# EAGLE design main (EAGLE 5.11)

## Sheet 1 of 6
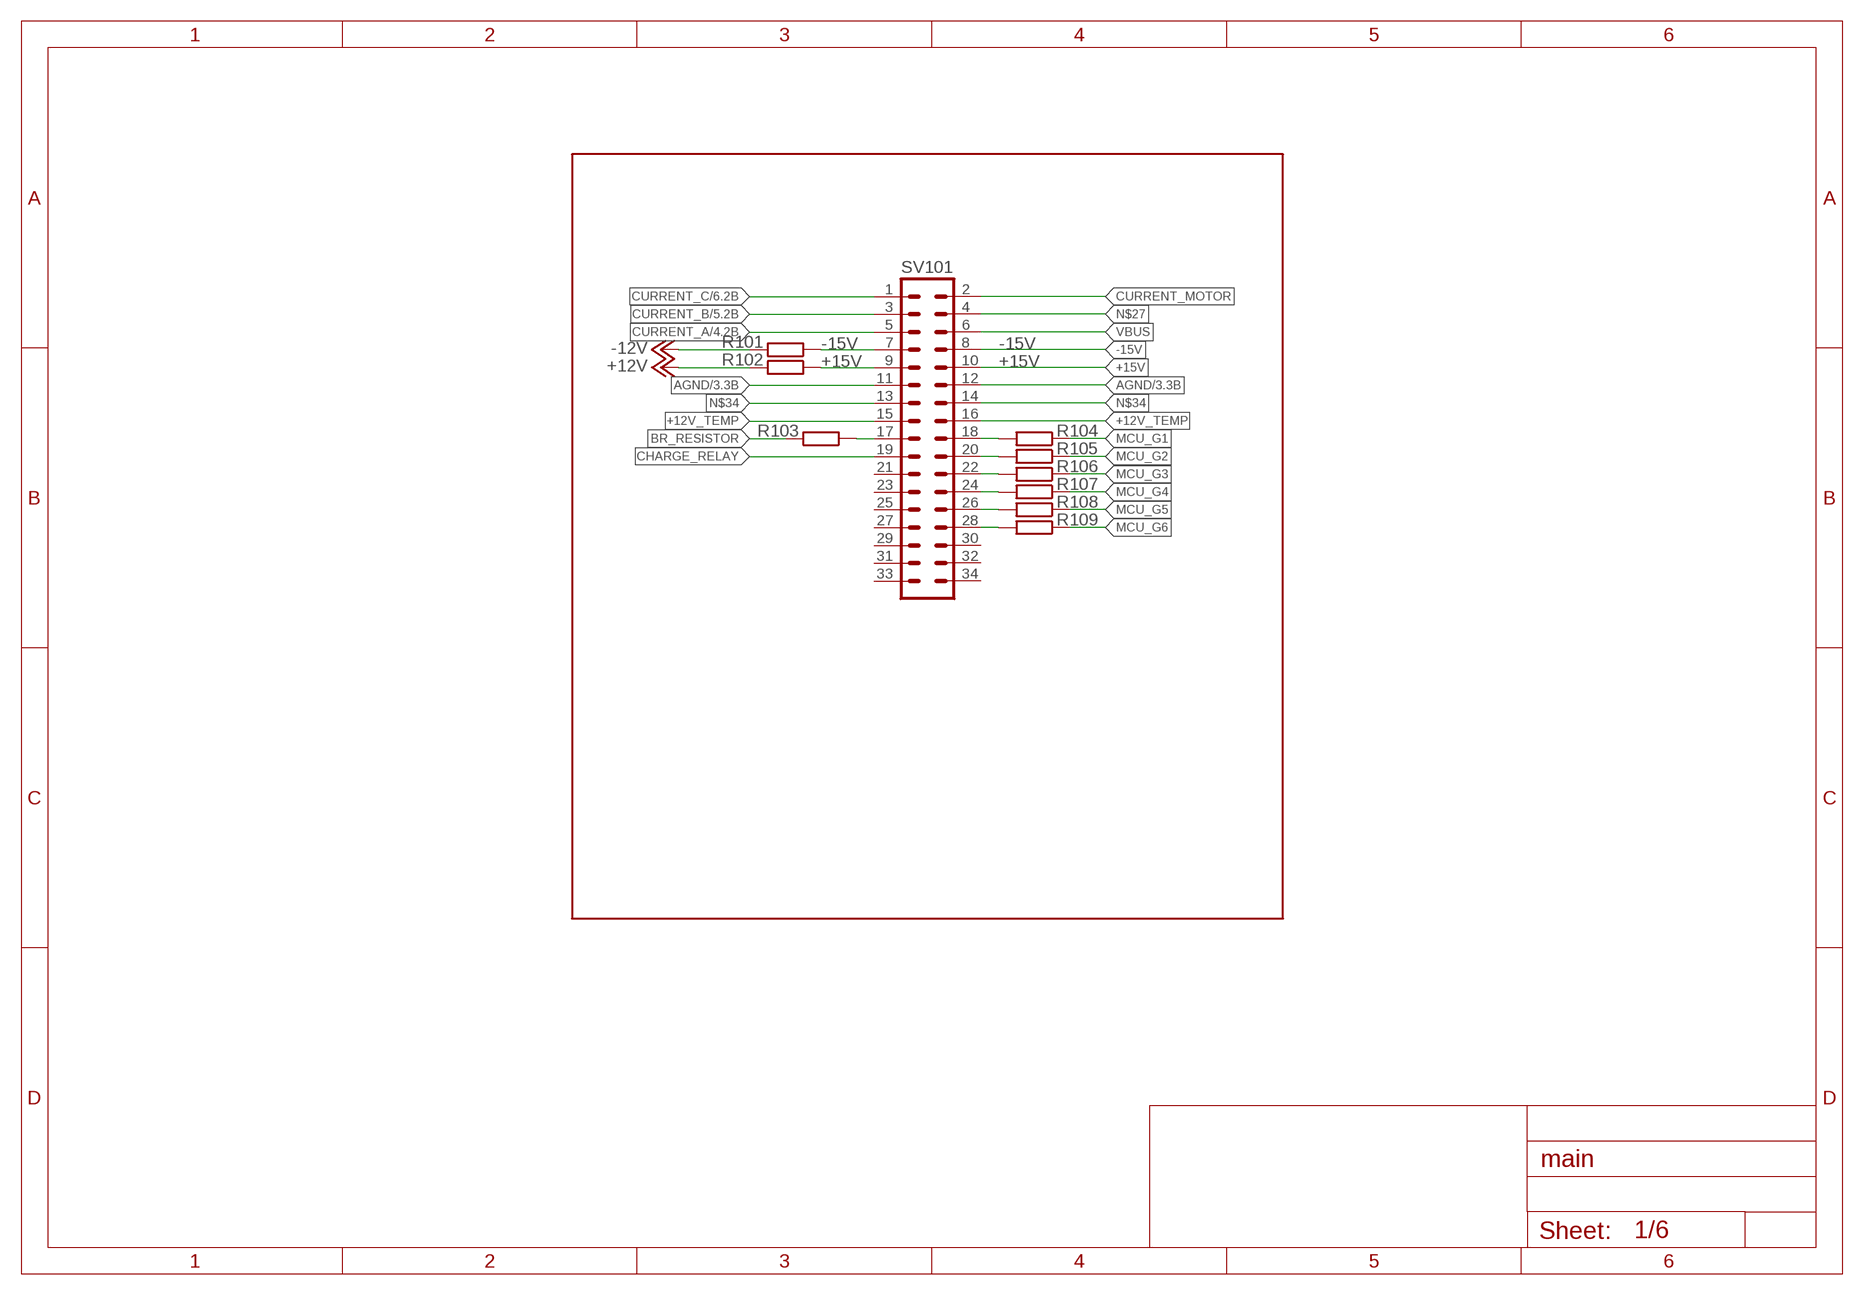
[diagram p0: schematic, sheet 1]

### Parts
R101  R-EU_0204/7  [0204/7]
R102  R-EU_0204/7  [0204/7]
R103  R-EU_R1206  [R1206]
R104  R-EU_R1206  [R1206]
R105  R-EU_R1206  [R1206]
R106  R-EU_R1206  [R1206]
R107  R-EU_R1206  [R1206]
R108  R-EU_R1206  [R1206]
R109  R-EU_R1206  [R1206]
SV101  ML34  [ML34]

### Nets
+12V: R102.2 ; also sheet 4,5,6
+12V_TEMP: SV101.15 SV101.16
+15V: R102.1 SV101.9 SV101.10
-12V: R101.2 ; also sheet 4,5,6
-15V: R101.1 SV101.7 SV101.8
AGND: SV101.11 SV101.12 ; also sheet 3,4,5,6
BR_RESISTOR: R103.2
CHARGE_RELAY: SV101.19
CURRENT_A: SV101.5 ; also sheet 4
CURRENT_B: SV101.3 ; also sheet 5
CURRENT_C: SV101.1 ; also sheet 6
CURRENT_MOTOR: SV101.2
MCU_G1: R104.1
MCU_G2: R105.1
MCU_G3: R106.1
MCU_G4: R107.1
MCU_G5: R108.1
MCU_G6: R109.1
N$27: SV101.4
N$30: R109.2 SV101.28
N$34: SV101.13 SV101.14
N$36: R104.2 SV101.18
N$37: R108.2 SV101.26
N$38: R107.2 SV101.24
N$39: R106.2 SV101.22
N$40: R105.2 SV101.20
N$41: R103.1 SV101.17
VBUS: SV101.6
Unconnected: SV101.21 SV101.23 SV101.25 SV101.27 SV101.29 SV101.30 SV101.31 SV101.32 SV101.33 SV101.34

## Sheet 2 of 6
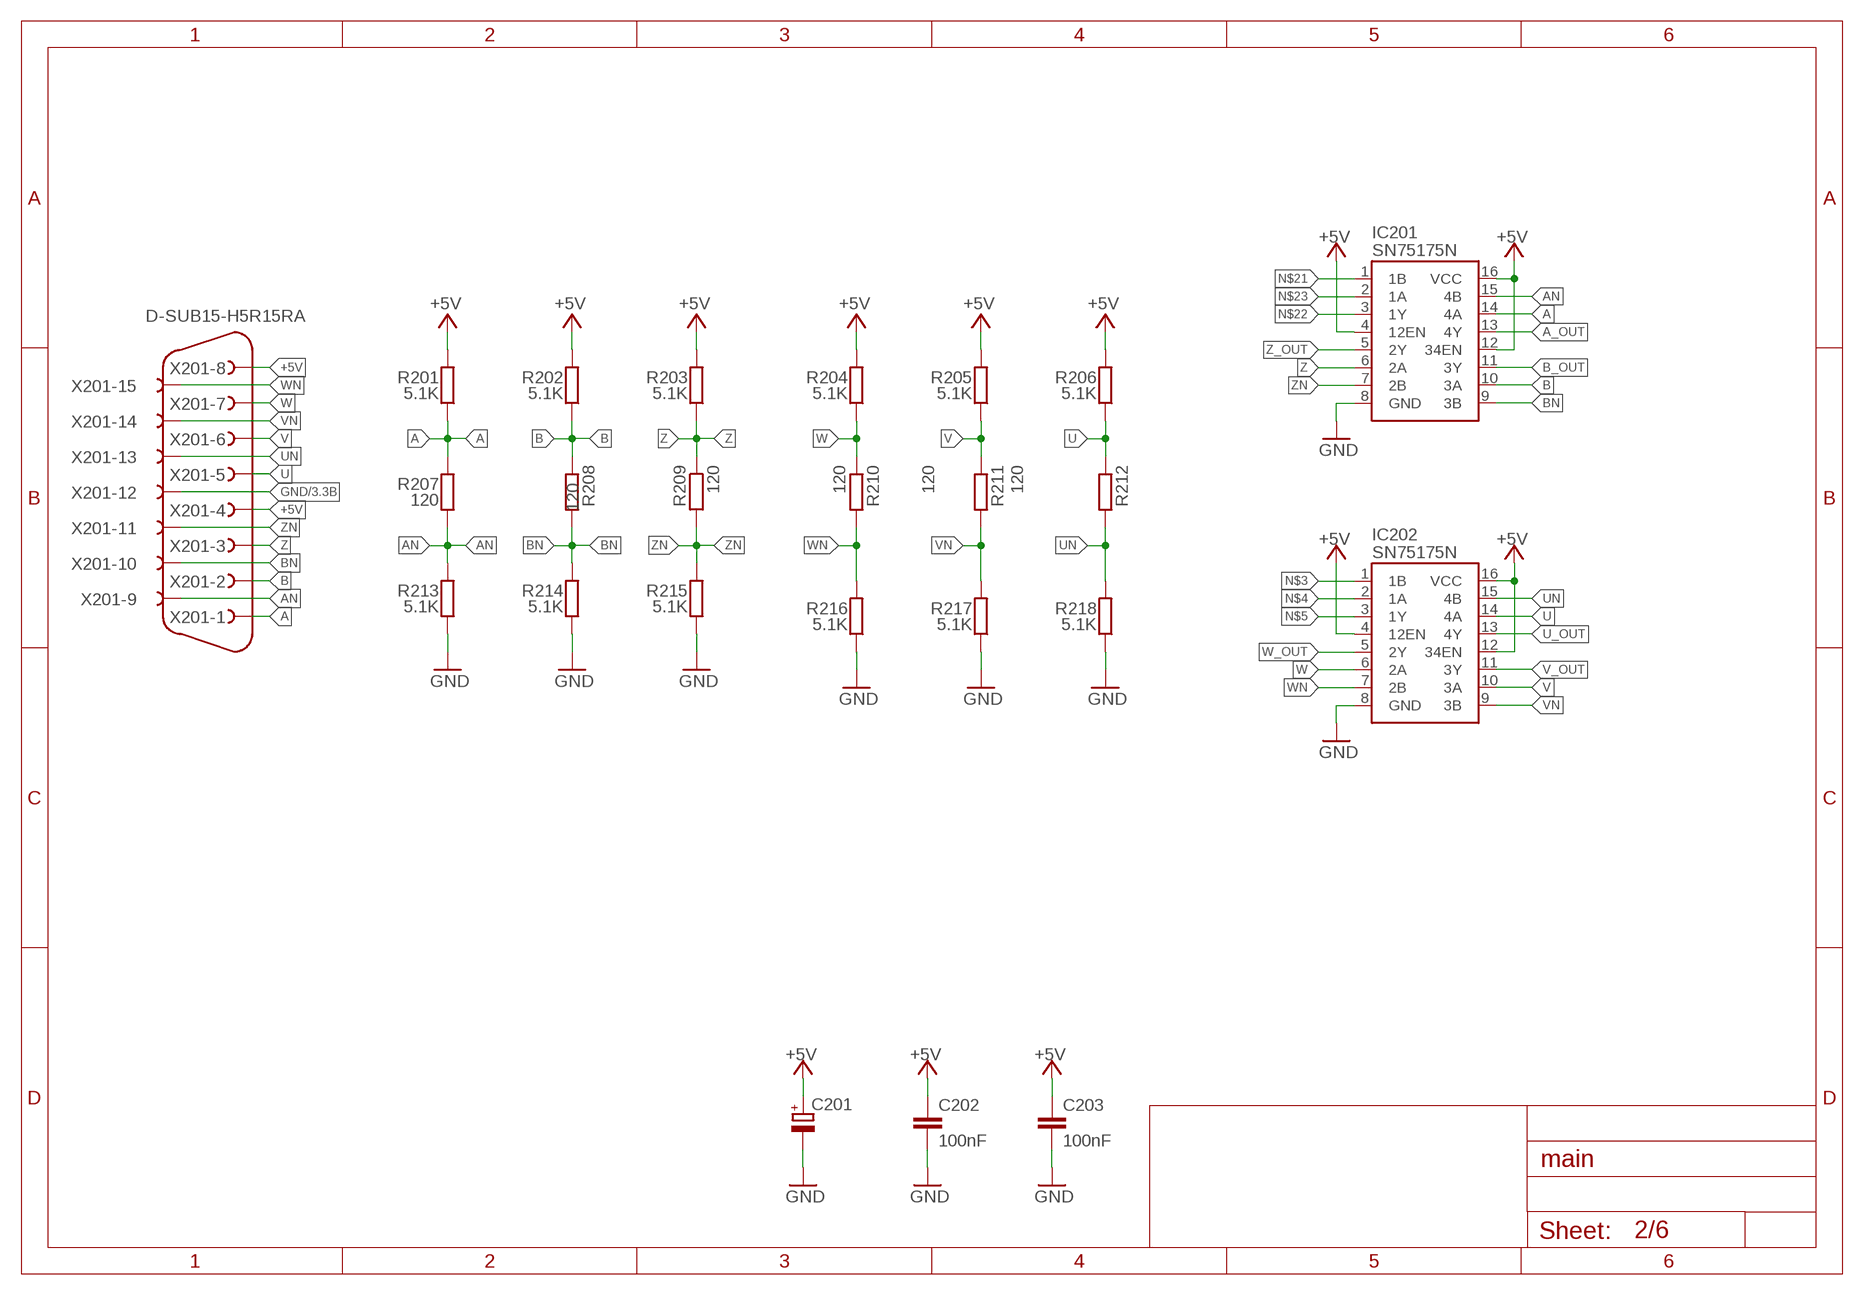
[diagram p1: schematic, sheet 2]

### Parts
C201  CPOL-EUE3.5-8  [E3,5-8]
C202  100nF  C-EUC0805  [C0805]
C203  100nF  C-EUC0805  [C0805]
IC201  SN75175N  SN7175N  [DIL16]
IC202  SN75175N  SN7175N  [DIL16]
R201  5.1K  R-EU_R0603  [R0603]
R202  5.1K  R-EU_R0603  [R0603]
R203  5.1K  R-EU_R0603  [R0603]
R204  5.1K  R-EU_R0603  [R0603]
R205  5.1K  R-EU_R0603  [R0603]
R206  5.1K  R-EU_R0603  [R0603]
R207  120  R-EU_R1206  [R1206]
R208  120  R-EU_R1206  [R1206]
R209  120  R-EU_R1206  [R1206]
R210  120  R-EU_R1206  [R1206]
R211  120  R-EU_R1206  [R1206]
R212  120  R-EU_R1206  [R1206]
R213  5.1K  R-EU_R0603  [R0603]
R214  5.1K  R-EU_R0603  [R0603]
R215  5.1K  R-EU_R0603  [R0603]
R216  5.1K  R-EU_R0603  [R0603]
R217  5.1K  R-EU_R0603  [R0603]
R218  5.1K  R-EU_R0603  [R0603]
X201  D-SUB15-H5R15RA  [H5R15RA]

### Nets
+5V: C201.+ C202.1 C203.1 IC201.4(12EN) IC201.12(34EN) IC201.16(VCC) IC202.4(12EN) IC202.12(34EN) IC202.16(VCC) R201.2 R202.2 R203.2 R204.2 R205.2 R206.2 X201.4 X201.8
A: IC201.14(4A) R201.1 R207.1 X201.1
A_OUT: IC201.13(4Y)
AN: IC201.15(4B) R207.2 R213.2 X201.9
B: IC201.10(3A) R202.1 R208.1 X201.2
B_OUT: IC201.11(3Y)
BN: IC201.9(3B) R208.2 R214.2 X201.10
GND: C201.- C202.2 C203.2 IC201.8(GND) IC202.8(GND) R213.1 R214.1 R215.1 R216.1 R217.1 R218.1 X201.12 ; also sheet 3,4,5,6
N$3: IC202.1(1B)
N$4: IC202.2(1A)
N$5: IC202.3(1Y)
N$21: IC201.1(1B)
N$22: IC201.3(1Y)
N$23: IC201.2(1A)
U: IC202.14(4A) R206.1 R212.1 X201.5
U_OUT: IC202.13(4Y)
UN: IC202.15(4B) R212.2 R218.2 X201.13
V: IC202.10(3A) R205.1 R211.1 X201.6
V_OUT: IC202.11(3Y)
VN: IC202.9(3B) R211.2 R217.2 X201.14
W: IC202.6(2A) R204.1 R210.1 X201.7
W_OUT: IC202.5(2Y)
WN: IC202.7(2B) R210.2 R216.2 X201.15
Z: IC201.6(2A) R203.1 R209.1 X201.3
Z_OUT: IC201.5(2Y)
ZN: IC201.7(2B) R209.2 R215.2 X201.11

## Sheet 3 of 6
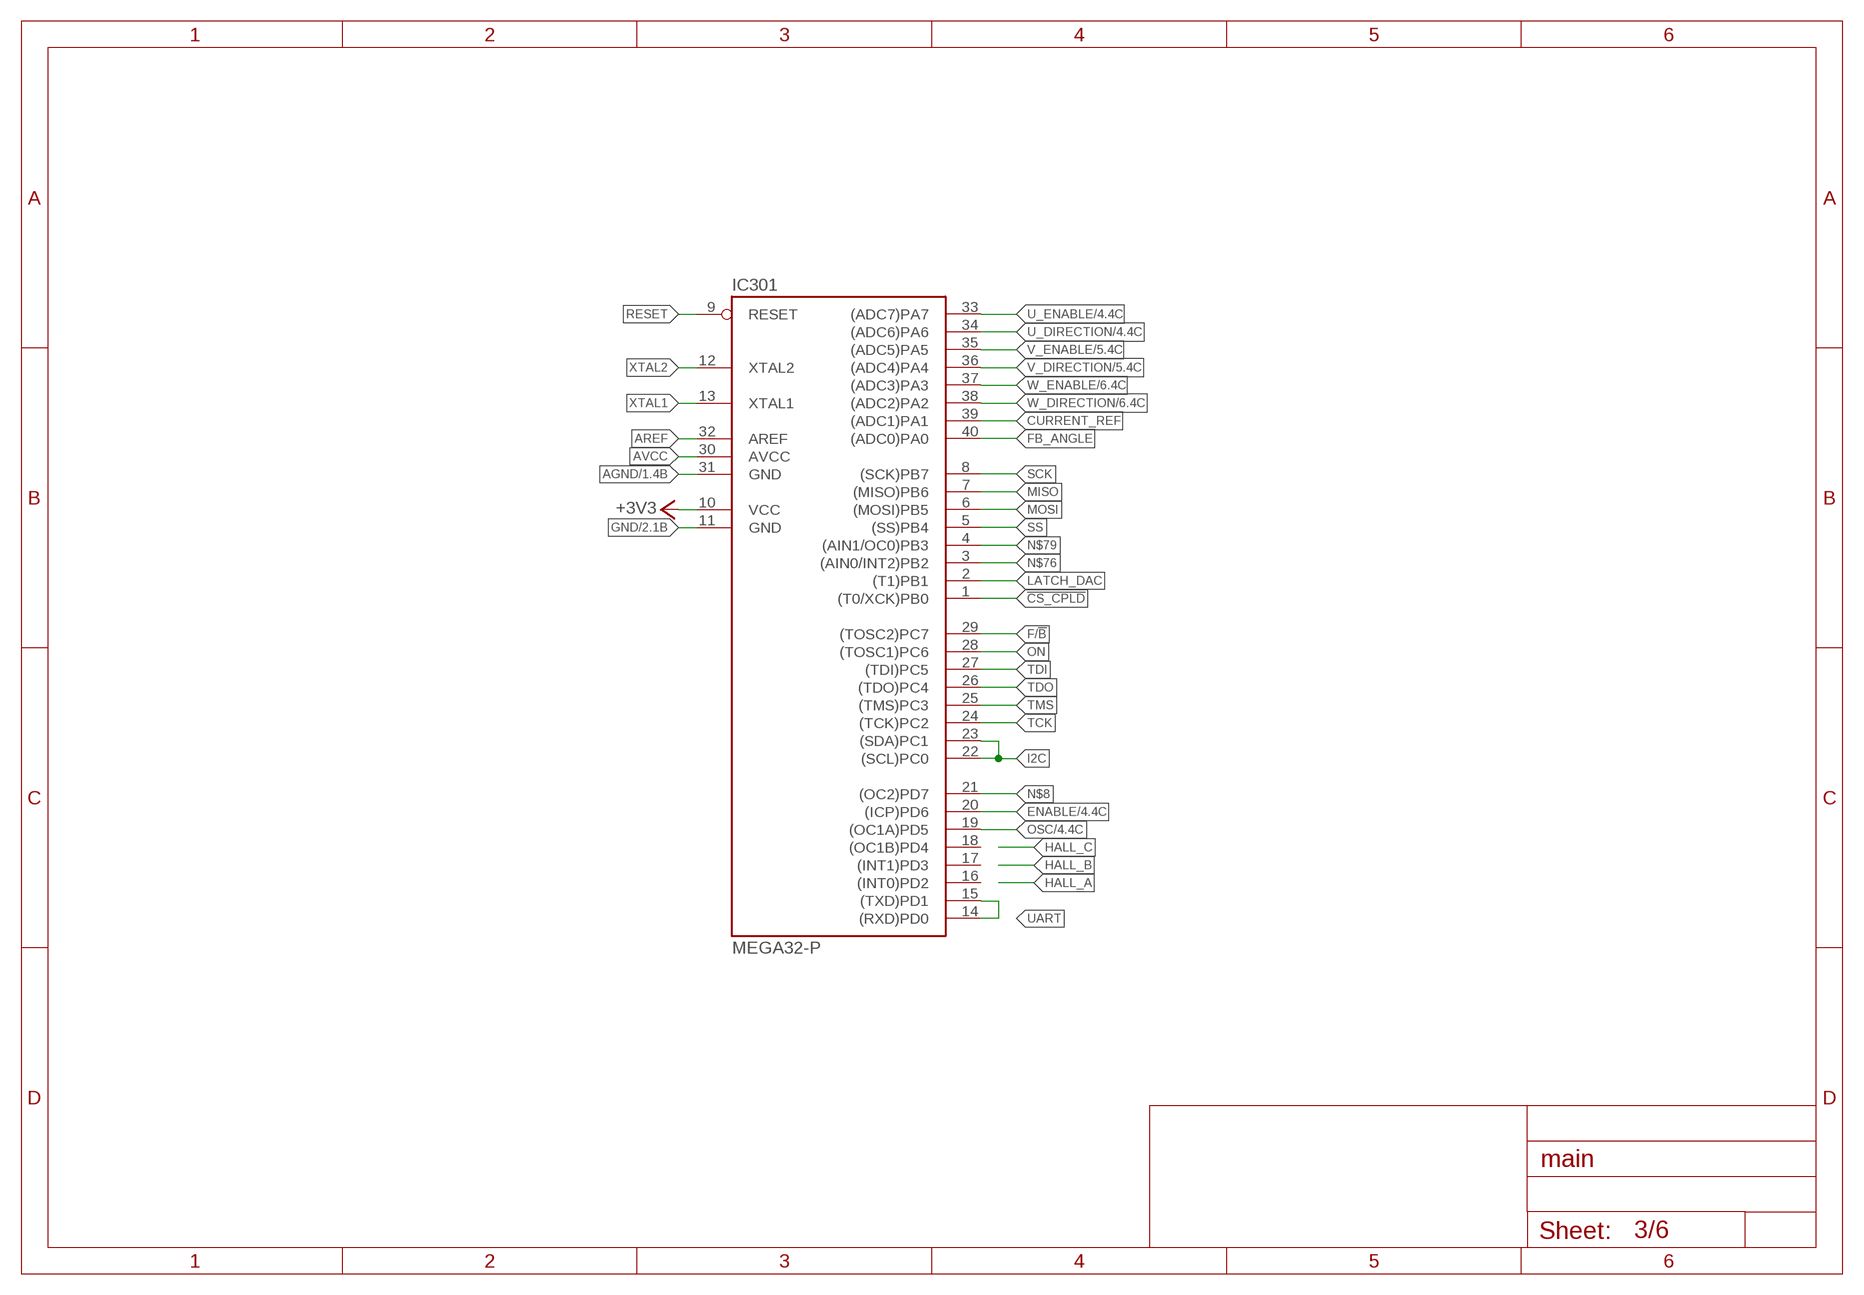
[diagram p2: schematic, sheet 3]

### Parts
IC301  MEGA32-P  [DIL40]

### Nets
!CS_CPLD: IC301.1((T0/XCK)PB0)
+3V3: IC301.10(VCC) ; also sheet 4,5,6
AGND: IC301.31(GND) ; also sheet 1,4,5,6
AREF: IC301.32(AREF)
AVCC: IC301.30(AVCC)
CURRENT_REF: IC301.39((ADC1)PA1)
ENABLE: IC301.20((ICP)PD6) ; also sheet 4,5,6
F/!B: IC301.29((TOSC2)PC7)
FB_ANGLE: IC301.40((ADC0)PA0)
GND: IC301.11(GND) ; also sheet 2,4,5,6
I2C: IC301.22((SCL)PC0) IC301.23((SDA)PC1)
LATCH_DAC: IC301.2((T1)PB1)
MISO: IC301.7((MISO)PB6)
MOSI: IC301.6((MOSI)PB5)
N$8: IC301.21((OC2)PD7)
N$76: IC301.3((AIN0/INT2)PB2)
N$79: IC301.4((AIN1/OC0)PB3)
ON: IC301.28((TOSC1)PC6)
OSC: IC301.19((OC1A)PD5) ; also sheet 4,5,6
RESET: IC301.9(RESET)
SCK: IC301.8((SCK)PB7)
SS: IC301.5((SS)PB4)
TCK: IC301.24((TCK)PC2)
TDI: IC301.27((TDI)PC5)
TDO: IC301.26((TDO)PC4)
TMS: IC301.25((TMS)PC3)
U_DIRECTION: IC301.34((ADC6)PA6) ; also sheet 4
U_ENABLE: IC301.33((ADC7)PA7) ; also sheet 4
UART: IC301.14((RXD)PD0) IC301.15((TXD)PD1)
V_DIRECTION: IC301.36((ADC4)PA4) ; also sheet 5
V_ENABLE: IC301.35((ADC5)PA5) ; also sheet 5
W_DIRECTION: IC301.38((ADC2)PA2) ; also sheet 6
W_ENABLE: IC301.37((ADC3)PA3) ; also sheet 6
XTAL1: IC301.13(XTAL1)
XTAL2: IC301.12(XTAL2)
Unconnected: IC301.16((INT0)PD2) IC301.17((INT1)PD3) IC301.18((OC1B)PD4)

## Sheet 4 of 6
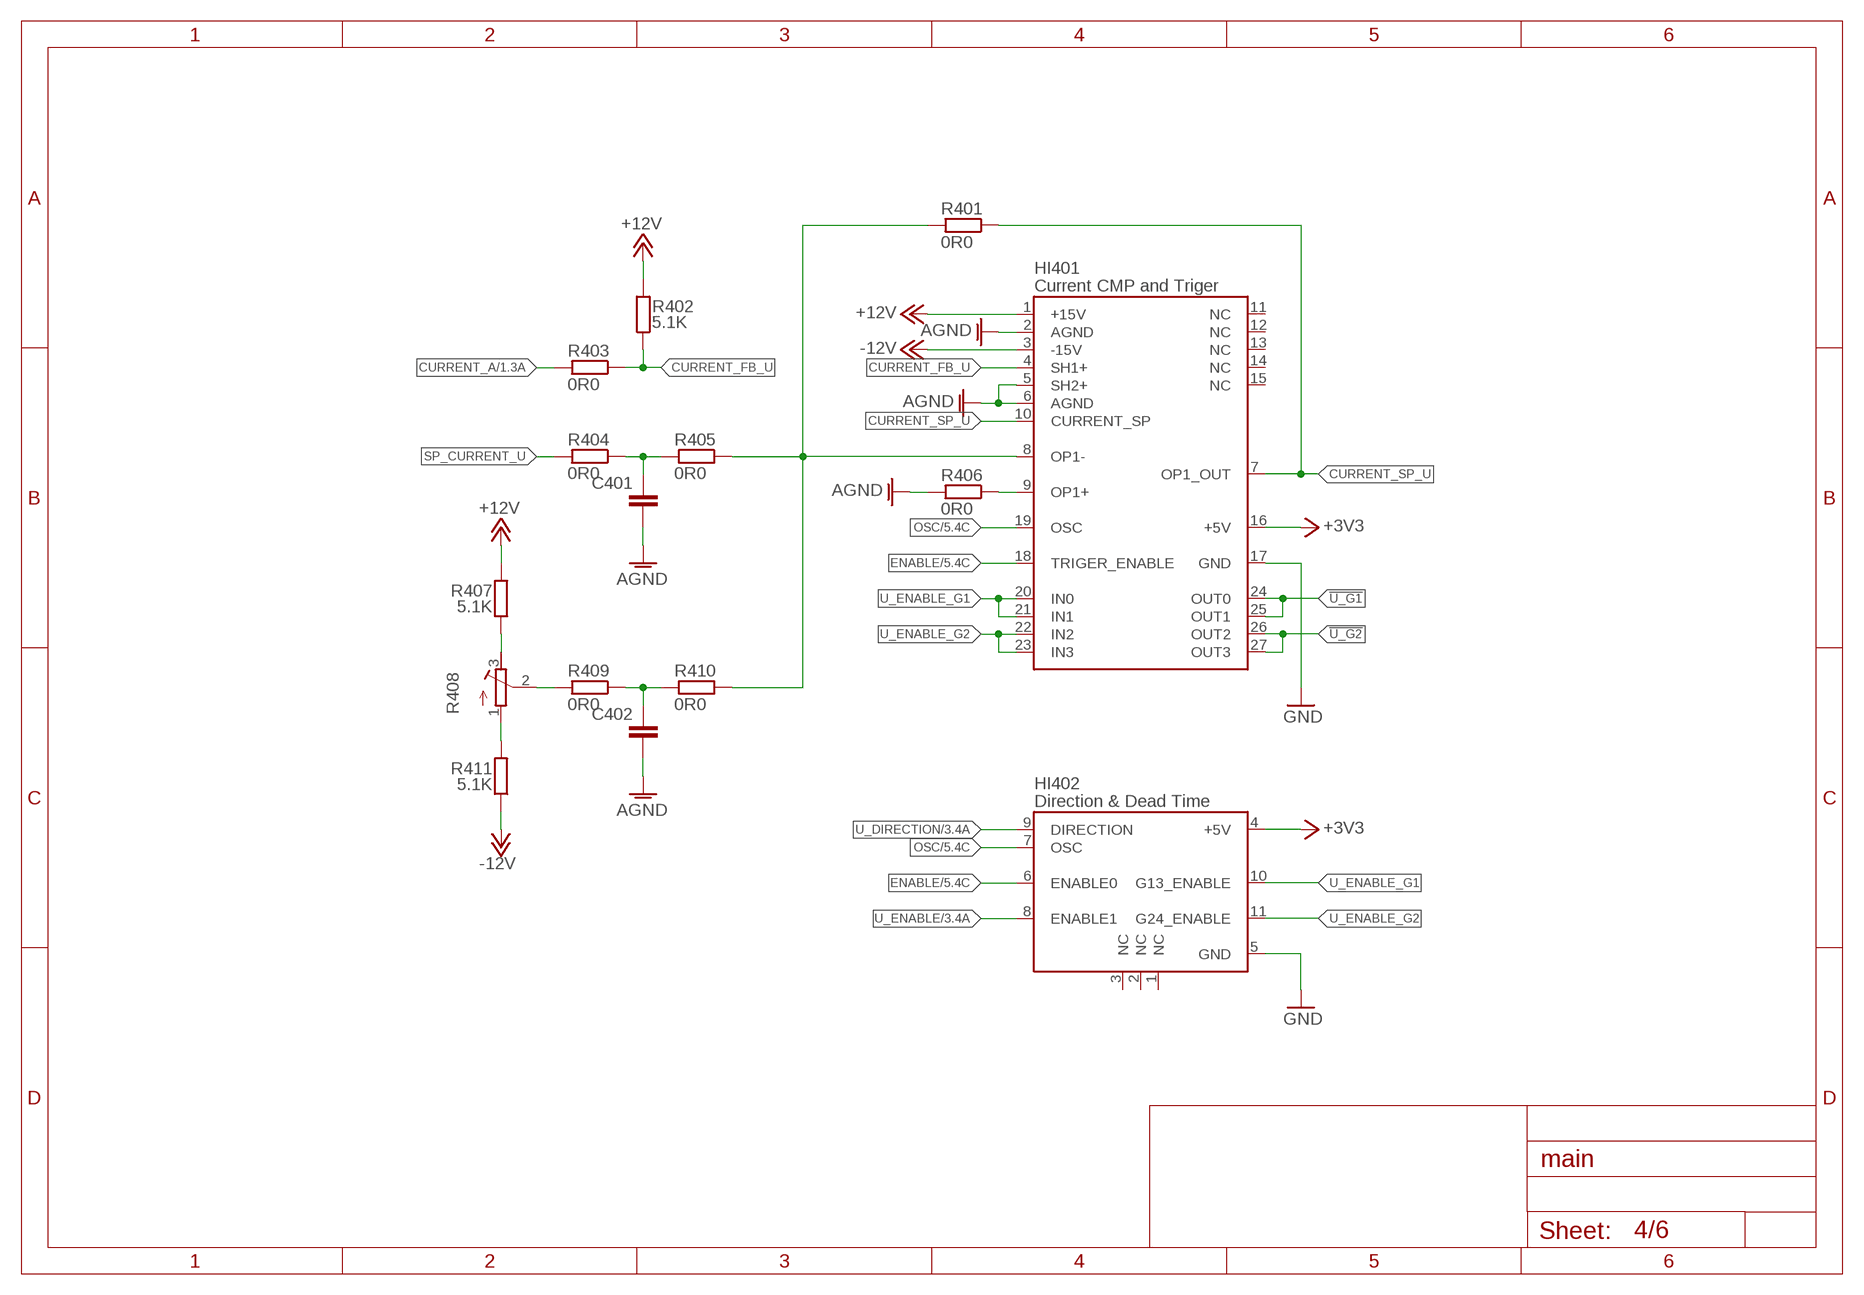
[diagram p3: schematic, sheet 4]

### Parts
C401  C-EU050-030X075  [C050-030X075]
C402  C-EU050-030X075  [C050-030X075]
HI401  Current CMP and Triger  19.05.15  [19.06.15_H]
HI402  Direction & Dead Time  19.05.15  [19.06.15_H]
R401  0R0  R-EU_0204/7  [0204/7]
R402  5.1K  R-EU_0204/7  [0204/7]
R403  0R0  R-EU_0204/7  [0204/7]
R404  0R0  R-EU_0204/7  [0204/7]
R405  0R0  R-EU_0204/7  [0204/7]
R406  0R0  R-EU_0204/7  [0204/7]
R407  5.1K  R-EU_0204/7  [0204/7]
R408  R-TRIMM3296W  [RTRIM3296W]
R409  0R0  R-EU_0204/7  [0204/7]
R410  0R0  R-EU_0204/7  [0204/7]
R411  5.1K  R-EU_0204/7  [0204/7]

### Nets
!U_G1: HI401.24(OUT0) HI401.25(OUT1)
!U_G2: HI401.26(OUT2) HI401.27(OUT3)
+3V3: HI401.16(+5V) HI402.4(+5V) ; also sheet 3,5,6
+12V: HI401.1(+15V) R402.2 R407.2 ; also sheet 1,5,6
-12V: HI401.3(-15V) R411.1 ; also sheet 1,5,6
AGND: C401.2 C402.2 HI401.2(AGND) HI401.5(SH2+) HI401.6(AGND) R406.2 ; also sheet 1,3,5,6
CURRENT_A: R403.2 ; also sheet 1
CURRENT_FB_U: HI401.4(SH1+) R402.1 R403.1
CURRENT_SP_U: HI401.7(OP1_OUT) HI401.10(CURRENT_SP) R401.1
ENABLE: HI401.18(TRIGER_ENABLE) HI402.6(ENABLE0) ; also sheet 3,5,6
GND: HI401.17(GND) HI402.5(GND) ; also sheet 2,3,5,6
N$55: HI401.8(OP1-) R401.2 R405.1 R410.1
N$56: C401.1 R404.1 R405.2
N$57: HI401.9(OP1+) R406.1
N$58: C402.1 R409.1 R410.2
N$59: R408.2(S) R409.2
N$60: R407.1 R408.3(A)
N$61: R408.1(E) R411.2
OSC: HI401.19(OSC) HI402.7(OSC) ; also sheet 3,5,6
SP_CURRENT_U: R404.2
U_DIRECTION: HI402.9(DIRECTION) ; also sheet 3
U_ENABLE: HI402.8(ENABLE1) ; also sheet 3
U_ENABLE_G1: HI401.20(IN0) HI401.21(IN1) HI402.10(G13_ENABLE)
U_ENABLE_G2: HI401.22(IN2) HI401.23(IN3) HI402.11(G24_ENABLE)
Unconnected: HI401.11(NC) HI401.12(NC) HI401.13(NC) HI401.14(NC) HI401.15(NC) HI402.1(NC) HI402.2(NC) HI402.3(NC)

## Sheet 5 of 6
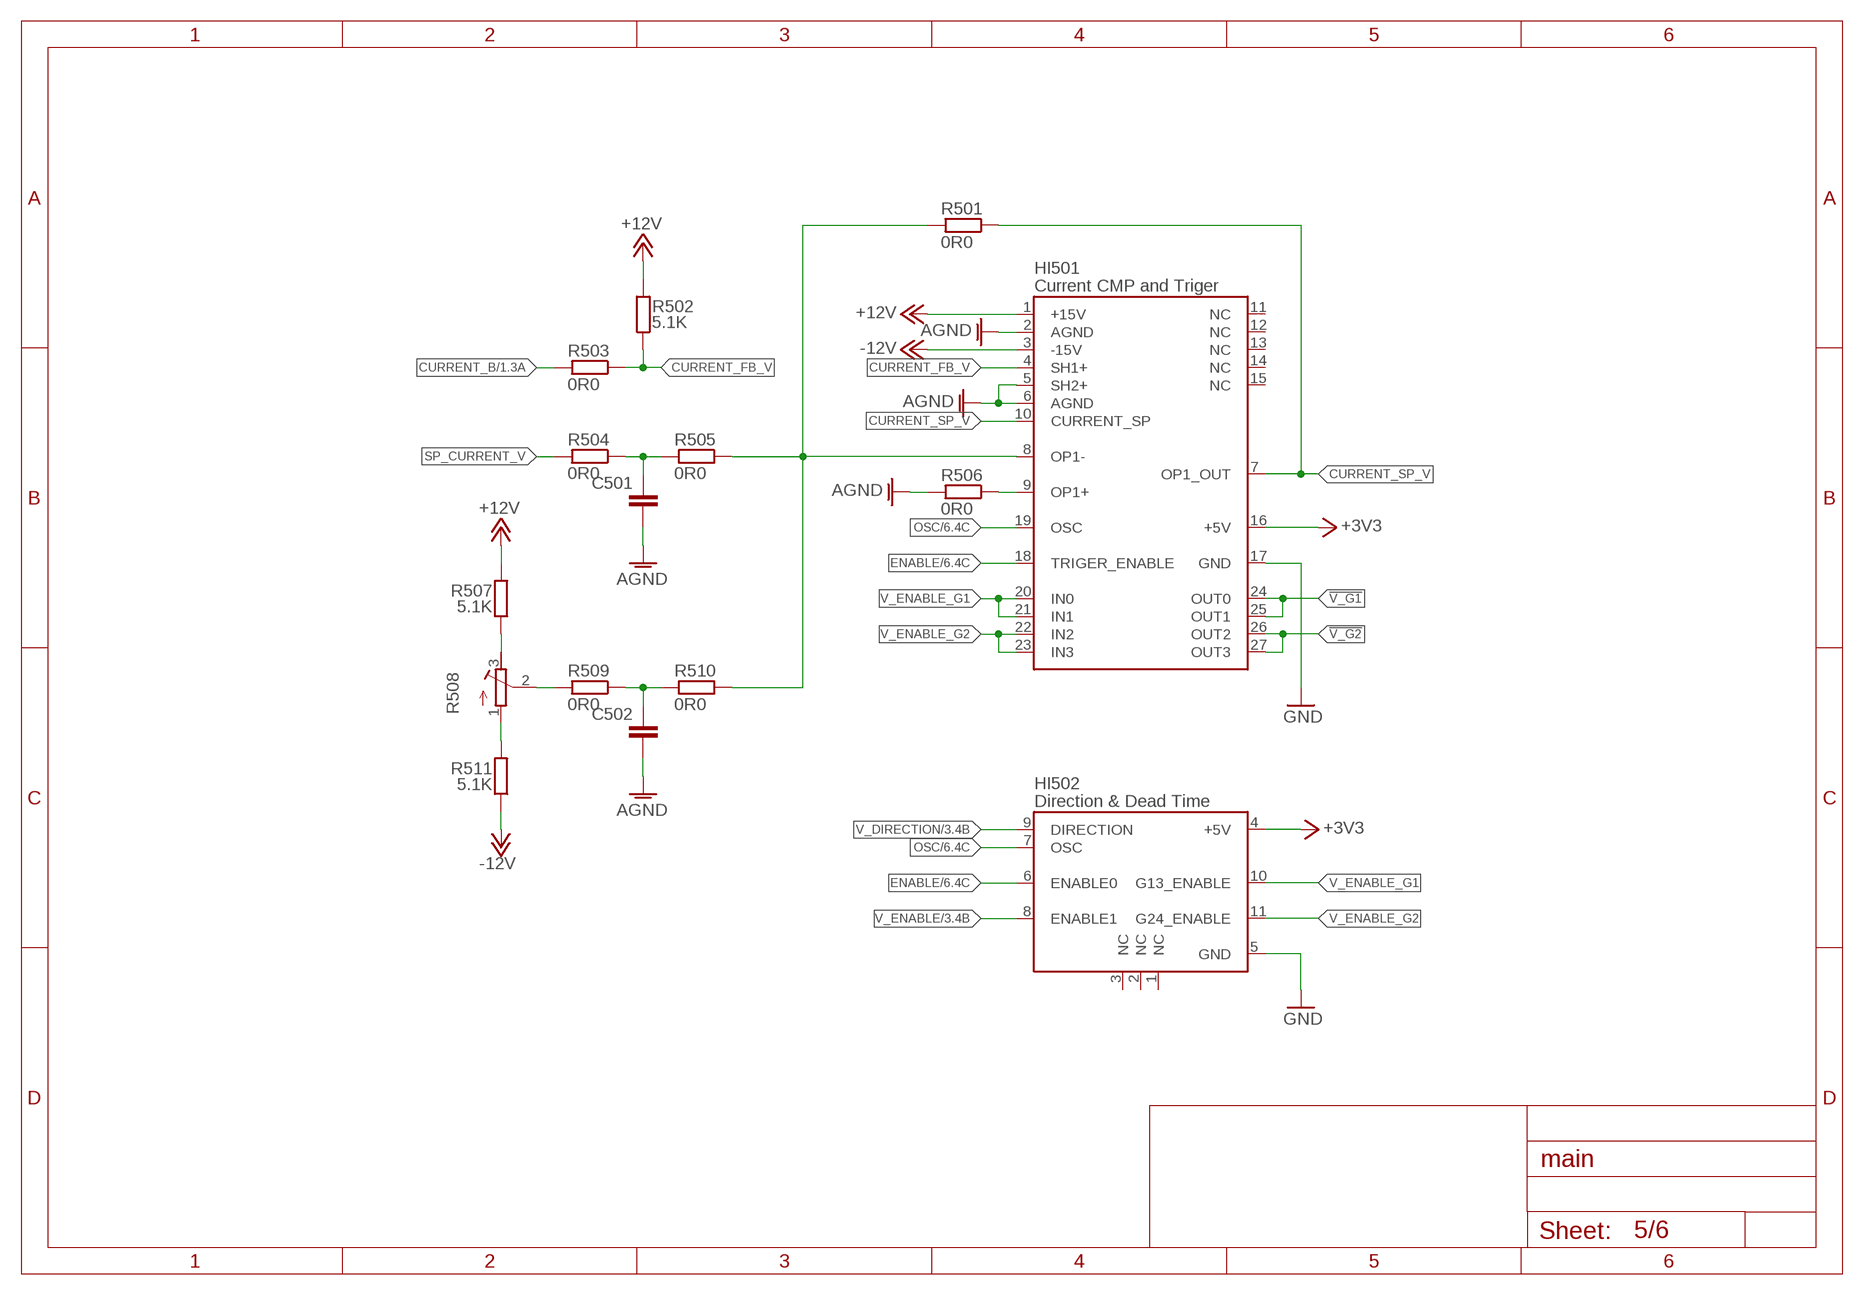
[diagram p4: schematic, sheet 5]

### Parts
C501  C-EU050-030X075  [C050-030X075]
C502  C-EU050-030X075  [C050-030X075]
HI501  Current CMP and Triger  19.05.15  [19.06.15_H]
HI502  Direction & Dead Time  19.05.15  [19.06.15_H]
R501  0R0  R-EU_0204/7  [0204/7]
R502  5.1K  R-EU_0204/7  [0204/7]
R503  0R0  R-EU_0204/7  [0204/7]
R504  0R0  R-EU_0204/7  [0204/7]
R505  0R0  R-EU_0204/7  [0204/7]
R506  0R0  R-EU_0204/7  [0204/7]
R507  5.1K  R-EU_0204/7  [0204/7]
R508  R-TRIMM3296W  [RTRIM3296W]
R509  0R0  R-EU_0204/7  [0204/7]
R510  0R0  R-EU_0204/7  [0204/7]
R511  5.1K  R-EU_0204/7  [0204/7]

### Nets
!V_G1: HI501.24(OUT0) HI501.25(OUT1)
!V_G2: HI501.26(OUT2) HI501.27(OUT3)
+3V3: HI501.16(+5V) HI502.4(+5V) ; also sheet 3,4,6
+12V: HI501.1(+15V) R502.2 R507.2 ; also sheet 1,4,6
-12V: HI501.3(-15V) R511.1 ; also sheet 1,4,6
AGND: C501.2 C502.2 HI501.2(AGND) HI501.5(SH2+) HI501.6(AGND) R506.2 ; also sheet 1,3,4,6
CURRENT_B: R503.2 ; also sheet 1
CURRENT_FB_V: HI501.4(SH1+) R502.1 R503.1
CURRENT_SP_V: HI501.7(OP1_OUT) HI501.10(CURRENT_SP) R501.1
ENABLE: HI501.18(TRIGER_ENABLE) HI502.6(ENABLE0) ; also sheet 3,4,6
GND: HI501.17(GND) HI502.5(GND) ; also sheet 2,3,4,6
N$62: HI501.8(OP1-) R501.2 R505.1 R510.1
N$63: C501.1 R504.1 R505.2
N$64: HI501.9(OP1+) R506.1
N$65: C502.1 R509.1 R510.2
N$66: R508.2(S) R509.2
N$67: R507.1 R508.3(A)
N$68: R508.1(E) R511.2
OSC: HI501.19(OSC) HI502.7(OSC) ; also sheet 3,4,6
SP_CURRENT_V: R504.2
V_DIRECTION: HI502.9(DIRECTION) ; also sheet 3
V_ENABLE: HI502.8(ENABLE1) ; also sheet 3
V_ENABLE_G1: HI501.20(IN0) HI501.21(IN1) HI502.10(G13_ENABLE)
V_ENABLE_G2: HI501.22(IN2) HI501.23(IN3) HI502.11(G24_ENABLE)
Unconnected: HI501.11(NC) HI501.12(NC) HI501.13(NC) HI501.14(NC) HI501.15(NC) HI502.1(NC) HI502.2(NC) HI502.3(NC)

## Sheet 6 of 6
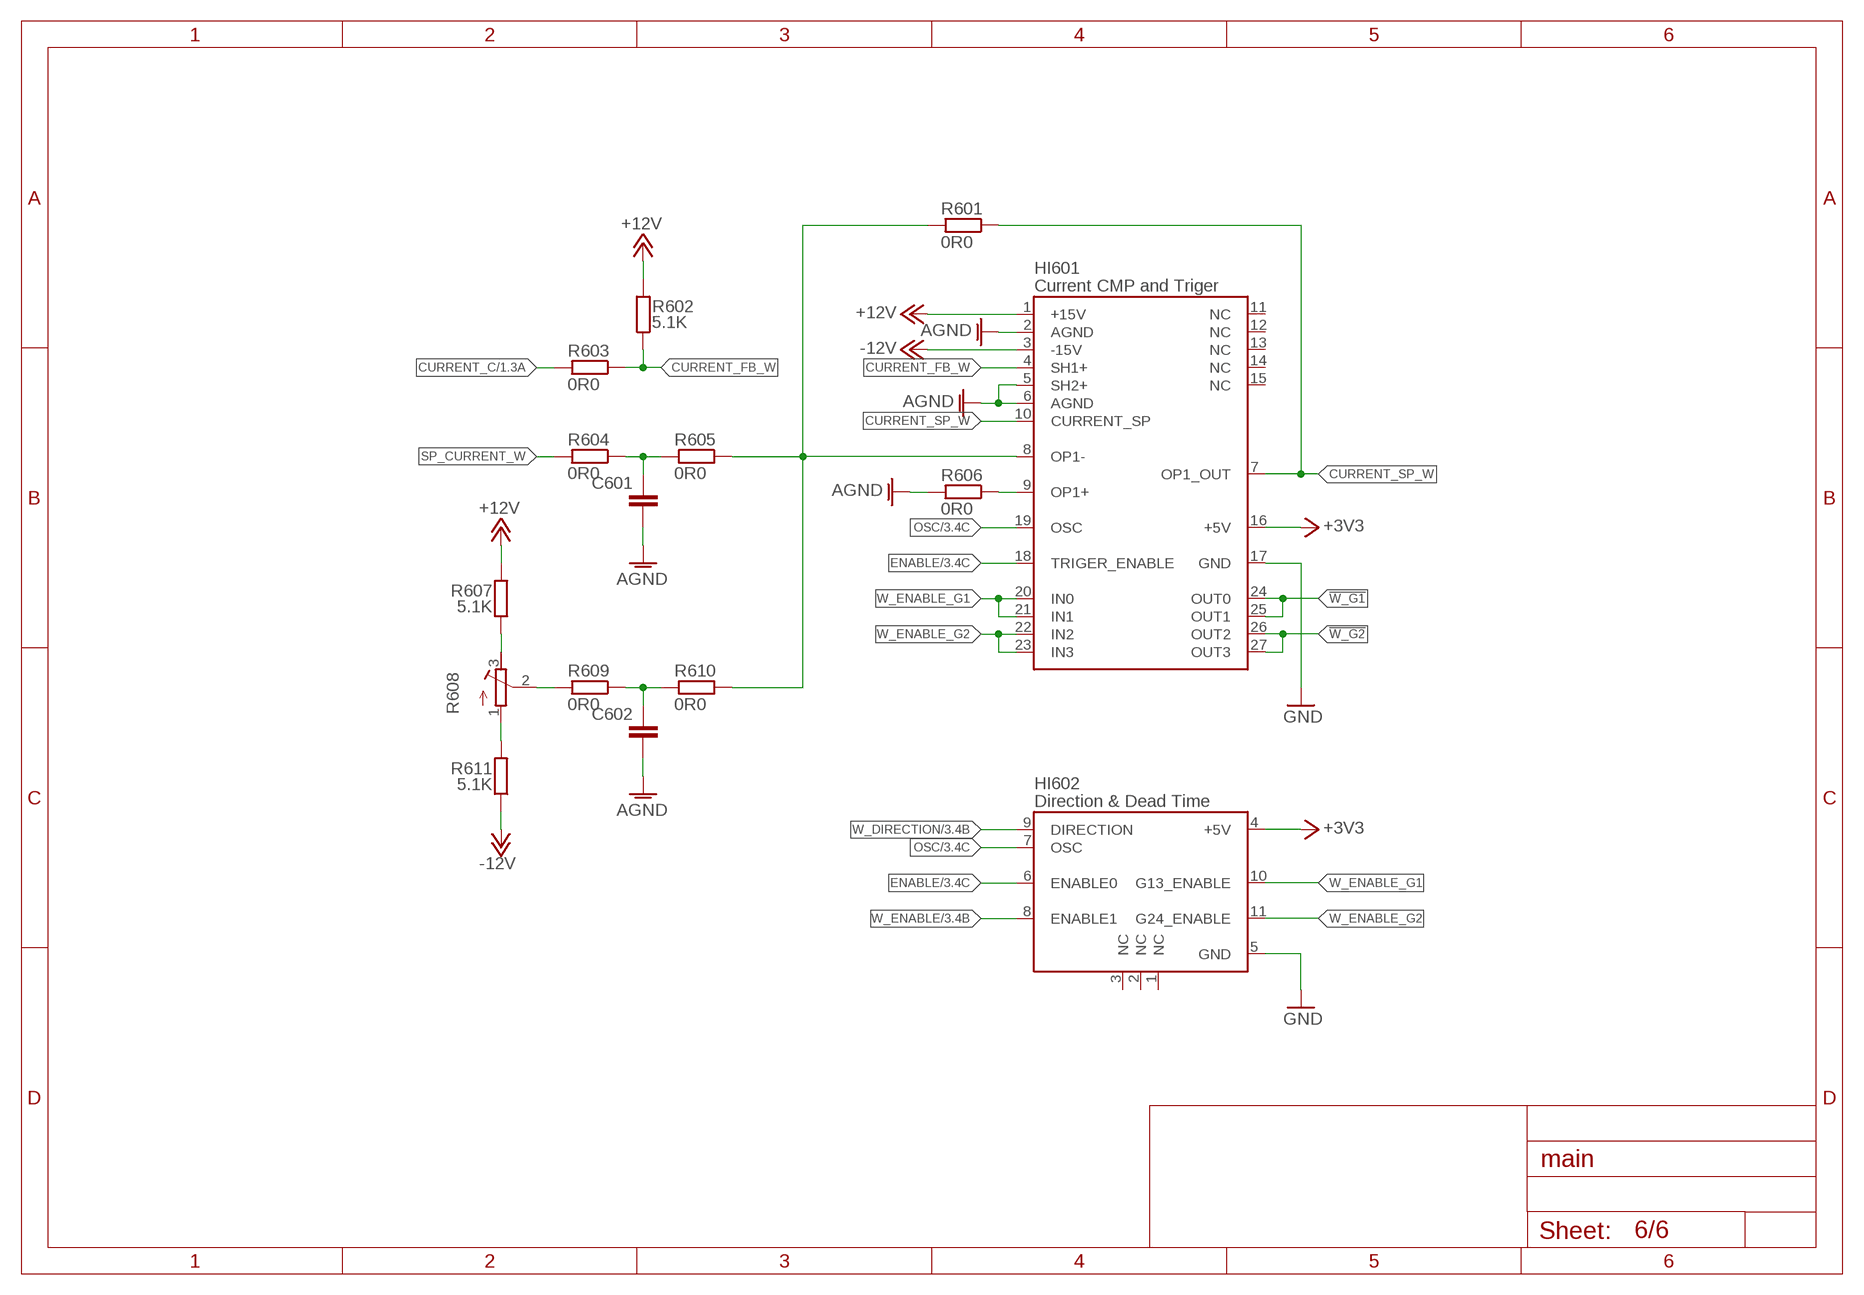
[diagram p5: schematic, sheet 6]

### Parts
C601  C-EU050-030X075  [C050-030X075]
C602  C-EU050-030X075  [C050-030X075]
HI601  Current CMP and Triger  19.05.15  [19.06.15_H]
HI602  Direction & Dead Time  19.05.15  [19.06.15_H]
R601  0R0  R-EU_0204/7  [0204/7]
R602  5.1K  R-EU_0204/7  [0204/7]
R603  0R0  R-EU_0204/7  [0204/7]
R604  0R0  R-EU_0204/7  [0204/7]
R605  0R0  R-EU_0204/7  [0204/7]
R606  0R0  R-EU_0204/7  [0204/7]
R607  5.1K  R-EU_0204/7  [0204/7]
R608  R-TRIMM3296W  [RTRIM3296W]
R609  0R0  R-EU_0204/7  [0204/7]
R610  0R0  R-EU_0204/7  [0204/7]
R611  5.1K  R-EU_0204/7  [0204/7]

### Nets
!W_G1: HI601.24(OUT0) HI601.25(OUT1)
!W_G2: HI601.26(OUT2) HI601.27(OUT3)
+3V3: HI601.16(+5V) HI602.4(+5V) ; also sheet 3,4,5
+12V: HI601.1(+15V) R602.2 R607.2 ; also sheet 1,4,5
-12V: HI601.3(-15V) R611.1 ; also sheet 1,4,5
AGND: C601.2 C602.2 HI601.2(AGND) HI601.5(SH2+) HI601.6(AGND) R606.2 ; also sheet 1,3,4,5
CURRENT_C: R603.2 ; also sheet 1
CURRENT_FB_W: HI601.4(SH1+) R602.1 R603.1
CURRENT_SP_W: HI601.7(OP1_OUT) HI601.10(CURRENT_SP) R601.1
ENABLE: HI601.18(TRIGER_ENABLE) HI602.6(ENABLE0) ; also sheet 3,4,5
GND: HI601.17(GND) HI602.5(GND) ; also sheet 2,3,4,5
N$69: HI601.8(OP1-) R601.2 R605.1 R610.1
N$70: C601.1 R604.1 R605.2
N$71: HI601.9(OP1+) R606.1
N$72: C602.1 R609.1 R610.2
N$73: R608.2(S) R609.2
N$74: R607.1 R608.3(A)
N$75: R608.1(E) R611.2
OSC: HI601.19(OSC) HI602.7(OSC) ; also sheet 3,4,5
SP_CURRENT_W: R604.2
W_DIRECTION: HI602.9(DIRECTION) ; also sheet 3
W_ENABLE: HI602.8(ENABLE1) ; also sheet 3
W_ENABLE_G1: HI601.20(IN0) HI601.21(IN1) HI602.10(G13_ENABLE)
W_ENABLE_G2: HI601.22(IN2) HI601.23(IN3) HI602.11(G24_ENABLE)
Unconnected: HI601.11(NC) HI601.12(NC) HI601.13(NC) HI601.14(NC) HI601.15(NC) HI602.1(NC) HI602.2(NC) HI602.3(NC)

## Library data of the parts
C201 = rcl:CPOL-EU: POLARIZED CAPACITOR, European symbol
C202 C203 C401 C402 C501 C502 C601 C602 = rcl:C-EU: CAPACITOR, European symbol
HI401 HI501 HI601 = Current PWM:19.05.15
HI402 HI502 HI602 = Dead Time:19.05.15
IC201 IC202 = myIC:SN7175*
IC301 = atmel:MEGA32-P: MICROCONTROLLER 32 Kbytes FLASH 2 Kbytes SRAM 1 Kbytes EEPROM USART 8-channel 10 bit ADC Source: www.atmel.com .. doc2503.pdf; MPN: ATMEGA32-16PU; OC_FARNELL: 1661729; OC_NEWARK: 51P1794
R101-R109 R201-R218 R401-R407 R409-R411 R501-R507 R509-R511 R601-R607 R609-R611 = rcl:R-EU_: RESISTOR, European symbol
R408 R508 R608 = rcl:R-TRIMM: Trimm resistor
SV101 = con-harting-ml:ML34: HARTING; OC_FARNELL: unknown; OC_NEWARK: unknown
X201 = con-thomas-betts:D-SUB15-: D-Subminiatur Connector Source: Electronioc Interconnects European Edition 1998; MF: TYCO ELECTRONICS; MPN: H5R15RA29B; OC_FARNELL: unknown; OC_NEWARK: 93F8335

## Board
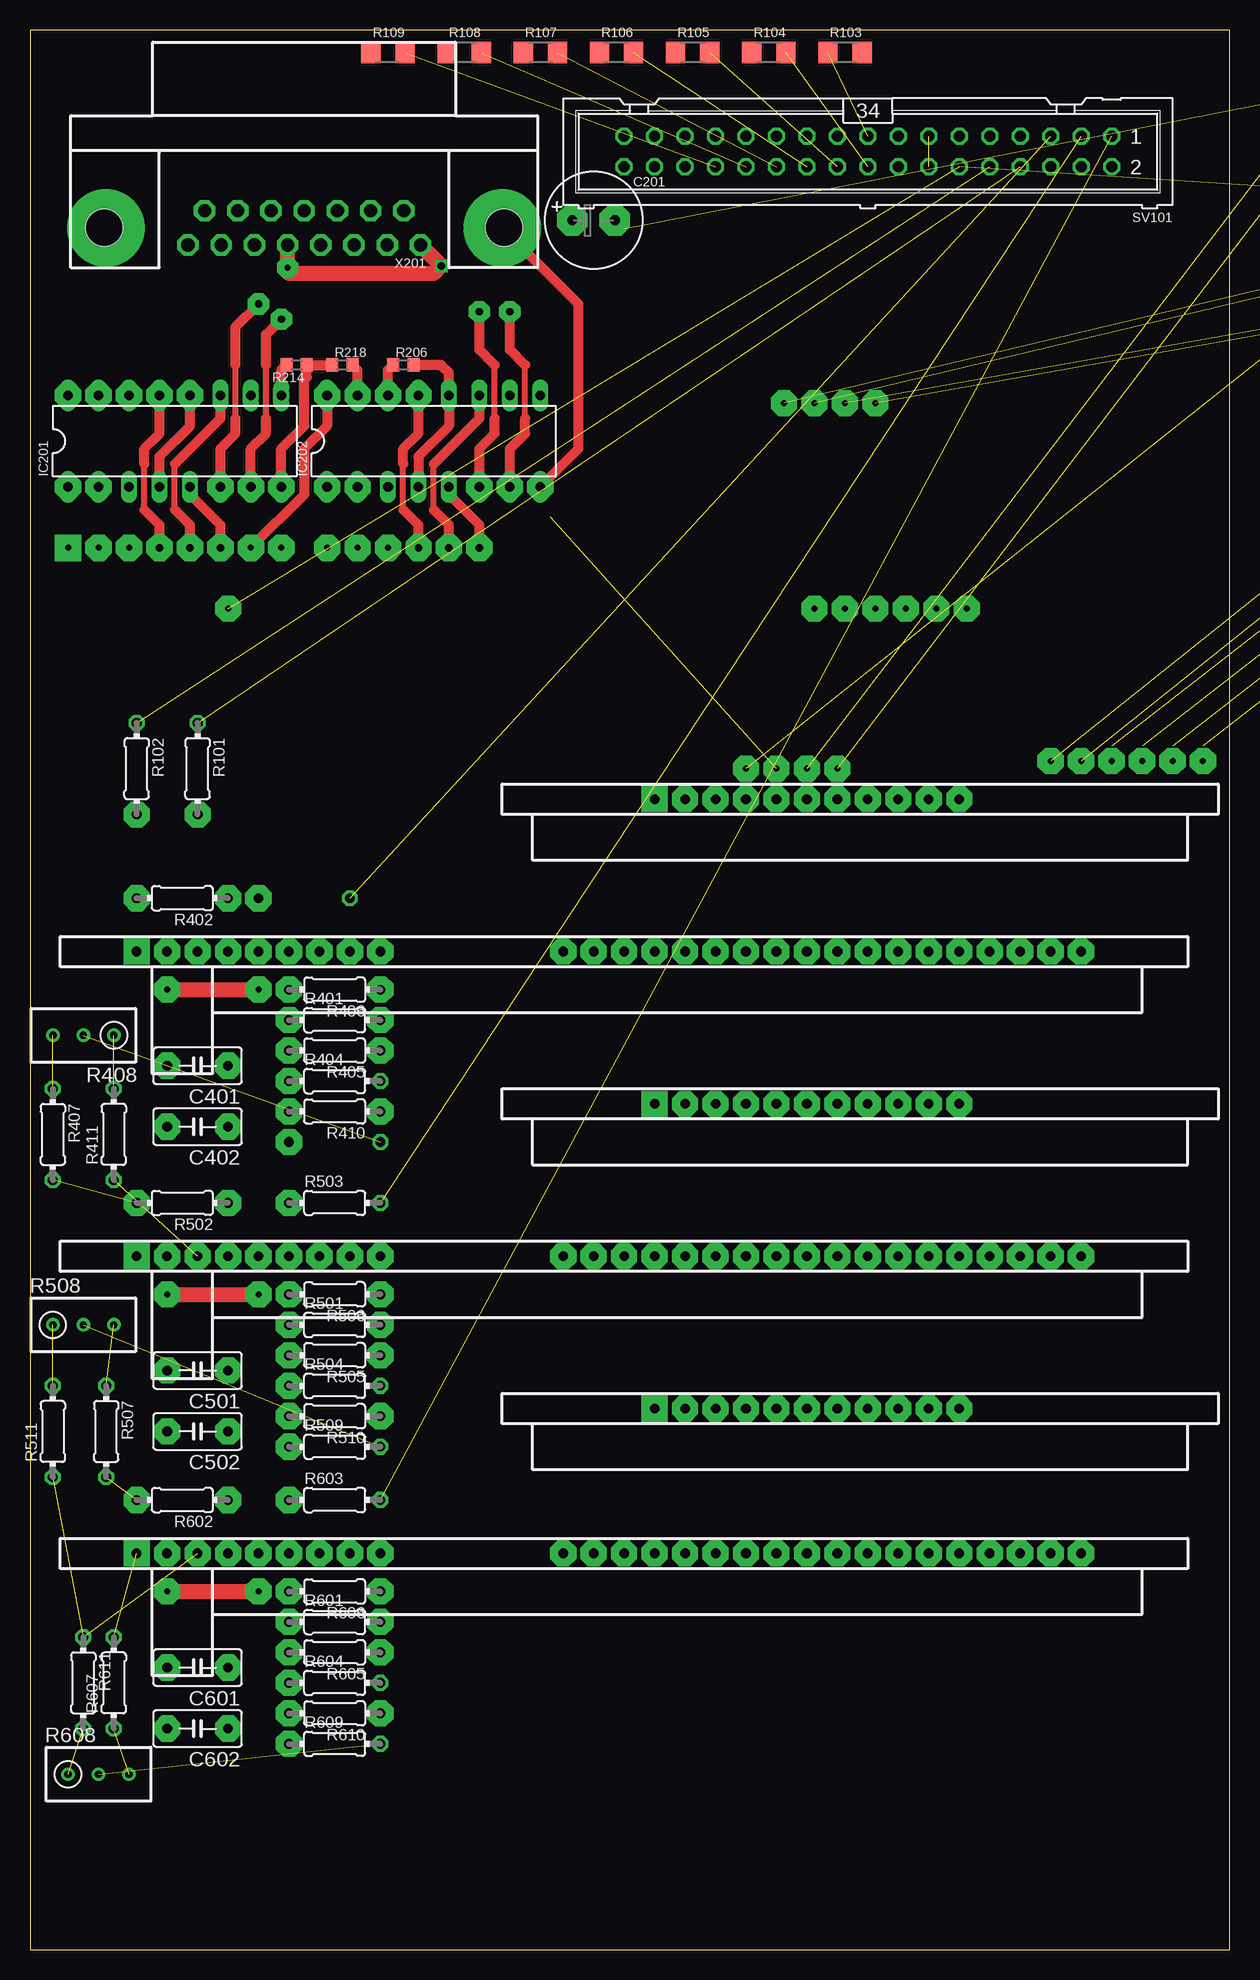
[diagram p6: board, top side]
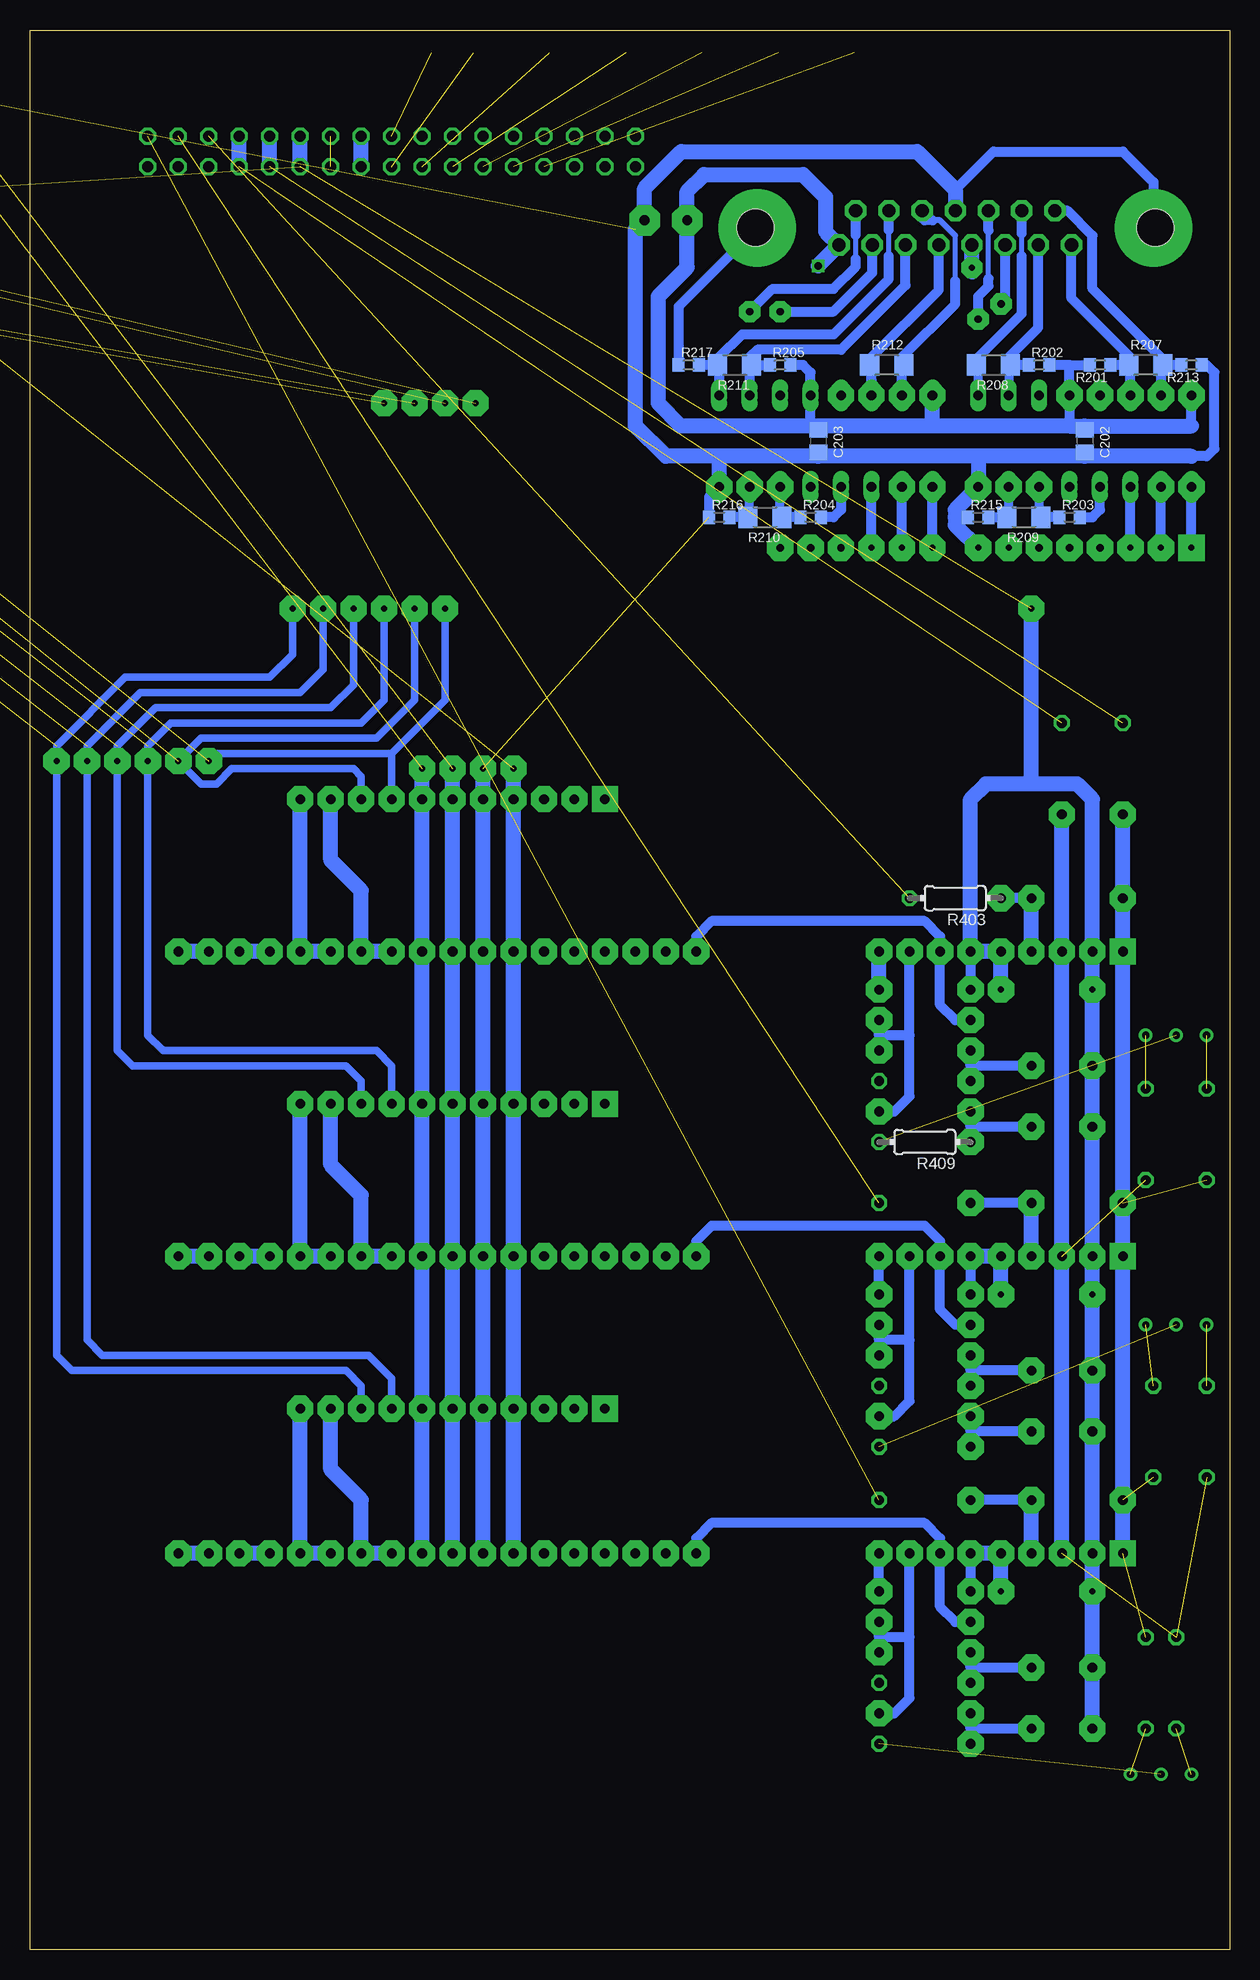
[diagram p7: board, bottom side, seen from below]

Size 100 x 160 mm. Coordinates in mm from the lower left corner, seen from the top.
Outline: 0,0 100,0 100,160 0,160 0,0
Copper layers (1*16): Top 0.035mm / dielectric 1.5mm / Bottom 0.035mm
Design rules "default": minimum track width 10mil, minimum drill 24mil, track to track 8mil, track to pad 8mil, pad to pad 8mil, via to via 8mil, smd to smd 8mil, copper to edge 40mil, drill to drill 8mil, minimum pad ring 10mil, minimum via ring 8mil, stop-mask expansion 4mil, vias tented up to drill 0mil, thermal gap 10mil

### Footprints (pad centres in the part's own frame; a part is rotated, then mirrored left to right if it is on the bottom)
E3,5-8 = drill 0.813 pad 1.6 round: + -1.778,0 | drill 0.813 pad 1.6 octagon: - 1.778,0
C0805 = smd 1.3 x 1.5: 1 -0.95,0; 2 0.95,0
C050-030X075 = drill 0.813 octagon: 1 -2.54,0; 2 2.54,0
19.06.15_H = drill 0.8 square: 1 0,0 | drill 0.8 octagon: 2 2.54,0; 3 5.08,0; 4 7.62,0; 5 10.16,0; 6 12.7,0; 7 15.24,0; 8 17.78,0; 9 20.32,0; 10 35.56,0; 11 38.1,0; 12 40.64,0; 13 43.18,0; 14 45.72,0; 15 48.26,0; 16 50.8,0; 17 53.34,0; 18 55.88,0; 19 58.42,0; 20 60.96,0; 21 63.5,0; 22 66.04,0; 23 68.58,0; 24 71.12,0; 25 73.66,0; 26 76.2,0; 27 78.74,0
19.06.15_H' = drill 0.8 square: 1 0,0 | drill 0.8 octagon: 2 2.54,0; 3 5.08,0; 4 7.62,0; 5 10.16,0; 6 12.7,0; 7 15.24,0; 8 17.78,0; 9 20.32,0; 10 22.86,0; 11 25.4,0
DIL16 = drill 0.813 long: 1 -8.89,-3.81; 2 -6.35,-3.81; 3 -3.81,-3.81; 4 -1.27,-3.81; 5 1.27,-3.81; 6 3.81,-3.81; 7 6.35,-3.81; 8 8.89,-3.81; 9 8.89,3.81; 10 6.35,3.81; 11 3.81,3.81; 12 1.27,3.81; 13 -1.27,3.81; 14 -3.81,3.81; 15 -6.35,3.81; 16 -8.89,3.81
DIL40 = drill 0.813 long: 1 -24.13,-7.62; 2 -21.59,-7.62; 3 -19.05,-7.62; 4 -16.51,-7.62; 5 -13.97,-7.62; 6 -11.43,-7.62; 7 -8.89,-7.62; 8 -6.35,-7.62; 9 -3.81,-7.62; 10 -1.27,-7.62; 11 1.27,-7.62; 12 3.81,-7.62; 13 6.35,-7.62; 14 8.89,-7.62; 15 11.43,-7.62; 16 13.97,-7.62; 17 16.51,-7.62; 18 19.05,-7.62; 19 21.59,-7.62; 20 24.13,-7.62; 21 24.13,7.62; 22 21.59,7.62; 23 19.05,7.62; 24 16.51,7.62; 25 13.97,7.62; 26 11.43,7.62; 27 8.89,7.62; 28 6.35,7.62; 29 3.81,7.62; 30 1.27,7.62; 31 -1.27,7.62; 32 -3.81,7.62; 33 -6.35,7.62; 34 -8.89,7.62; 35 -11.43,7.62; 36 -13.97,7.62; 37 -16.51,7.62; 38 -19.05,7.62; 39 -21.59,7.62; 40 -24.13,7.62
0204/7 = drill 0.813 octagon: 1 -3.81,0; 2 3.81,0
R1206 = smd 1.6 x 1.803: 1 -1.422,0; 2 1.422,0
R0603 = smd 1 x 1.1: 1 -0.85,0; 2 0.85,0
RTRIM3296W = drill 0.61 round: 1 0,-2.54; 2 0,0; 3 0,2.54
ML34 = drill 0.914 octagon: 1 -20.32,-1.27; 2 -20.32,1.27; 3 -17.78,-1.27; 4 -17.78,1.27; 5 -15.24,-1.27; 6 -15.24,1.27; 7 -12.7,-1.27; 8 -12.7,1.27; 9 -10.16,-1.27; 10 -10.16,1.27; 11 -7.62,-1.27; 12 -7.62,1.27; 13 -5.08,-1.27; 14 -5.08,1.27; 15 -2.54,-1.27; 16 -2.54,1.27; 17 0,-1.27; 18 0,1.27; 19 2.54,-1.27; 20 2.54,1.27; 21 5.08,-1.27; 22 5.08,1.27; 23 7.62,-1.27; 24 7.62,1.27; 25 10.16,-1.27; 26 10.16,1.27; 27 12.7,-1.27; 28 12.7,1.27; 29 15.24,-1.27; 30 15.24,1.27; 31 17.78,-1.27; 32 17.78,1.27; 33 20.32,-1.27; 34 20.32,1.27
H5R15RA = drill 1.092 round: 1 9.69,1.422; 2 6.921,1.422; 3 4.153,1.422; 4 1.384,1.422; 5 -1.384,1.422; 6 -4.153,1.422; 7 -6.921,1.422; 8 -9.69,1.422; 9 8.306,-1.422; 10 5.537,-1.422; 11 2.769,-1.422; 12 0,-1.422; 13 -2.769,-1.422; 14 -5.537,-1.422; 15 -8.306,-1.422 | hole 3.048: -16.662,0; 16.662,0

### Placement (x,y rotation side)
C201  46.99,144.15 0 top
C202  12.06,125.73 270 bottom
C203  34.29,125.73 270 bottom
C401  13.97,73.66 180 top
C402  13.97,68.58 180 top
C501  13.97,48.26 180 top
C502  13.97,43.18 180 top
C601  13.97,23.5 180 top
C602  13.97,18.41 180 top
HI401  8.89,83.19 0 top
HI402  Direction & Dead Time  [19.06.15_H']  52.07,95.89 0 top
HI501  8.89,57.78 0 top
HI502  Direction & Dead Time  [19.06.15_H']  52.07,70.48 0 top
HI601  8.89,33.02 0 top
HI602  Direction & Dead Time  [19.06.15_H']  52.07,45.09 0 top
IC201  12.06,125.73 0 top
IC202  33.66,125.73 0 top
IC301  135.89,152.4 180 top  (outside the outline)
R101  13.97,98.42 270 top
R102  8.89,98.42 270 top
R103  67.94,158.12 0 top
R104  61.59,158.12 0 top
R105  55.24,158.12 0 top
R106  48.9,158.12 0 top
R107  42.55,158.12 0 top
R108  36.2,158.12 0 top
R109  29.84,158.12 0 top
R201  10.79,132.08 180 bottom
R202  15.88,132.08 0 bottom
R203  13.34,119.38 0 bottom
R204  34.92,119.38 0 bottom
R205  37.47,132.08 0 bottom
R206  31.11,132.08 0 top
R207  6.99,132.08 0 bottom
R208  19.68,132.08 180 bottom
R209  17.14,119.38 180 bottom
R210  38.73,119.38 180 bottom
R211  41.27,132.08 180 bottom
R212  28.57,132.08 0 bottom
R213  3.17,132.08 180 bottom
R214  22.23,132.08 180 top
R215  20.95,119.38 0 bottom
R216  42.55,119.38 0 bottom
R217  45.09,132.08 0 bottom
R218  26.04,132.08 0 top
R401  25.4,77.47 0 top
R402  12.7,87.63 180 top
R403  22.86,87.63 180 bottom
R404  25.4,72.39 0 top
R405  25.4,74.93 180 top
R406  25.4,80.01 180 top
R407  1.91,67.94 270 top
R408  4.45,76.2 90 top
R409  25.4,67.31 180 bottom
R410  25.4,69.85 180 top
R411  6.99,67.94 90 top
R501  25.4,52.07 0 top
R502  12.7,62.23 180 top
R503  25.4,62.23 0 top
R504  25.4,46.99 0 top
R505  25.4,49.53 180 top
R506  25.4,54.61 180 top
R507  6.35,43.18 270 top
R508  4.45,52.07 270 top
R509  25.4,41.91 0 top
R510  25.4,44.45 180 top
R511  1.91,43.18 90 top
R601  25.4,27.3 0 top
R602  12.7,37.47 180 top
R603  25.4,37.47 0 top
R604  25.4,22.23 0 top
R605  25.4,24.77 180 top
R606  25.4,29.84 180 top
R607  6.99,22.23 90 top
R608  5.71,14.61 270 top
R609  25.4,17.14 0 top
R610  25.4,19.68 180 top
R611  4.45,22.23 270 top
SV101  69.85,149.86 180 top
X201  22.86,143.51 180 top

### Tracks (layer width: path | path; a pad name or v marks a point on that pad's centre or on a via)
!U_G1  (via drill 0.5 pad 2.18)
  Bottom 1.27: HI401.24 HI401.25
  other vias: 80.01,83.19 82.55,83.19
!U_G2  (via drill 0.5 pad 2.18)
  Bottom 1.27: HI401.26 HI401.27
  other vias: 85.09,83.19 87.63,83.19
!V_G1  (via drill 0.5 pad 2.18)
  Bottom 1.27: HI501.24 HI501.25
  other vias: 80.01,57.78 82.55,57.78
!V_G2  (via drill 0.5 pad 2.18)
  Bottom 1.27: HI501.26 HI501.27
  other vias: 85.09,57.78 87.63,57.78
!W_G1  (via drill 0.5 pad 2.18)
  Bottom 1.27: HI601.24 HI601.25
  other vias: 82.55,33.02 80.01,33.02
!W_G2  (via drill 0.5 pad 2.18)
  Bottom 1.27: HI601.26 HI601.27
  other vias: 85.09,33.02 87.63,33.02
+3V3  (via drill 0.5 pad 2.18)  (1 unrouted)
  Bottom 1.27: HI601.16 HI602.4 HI501.16 HI502.4 HI401.16 HI402.4 v59.69,98.42
  other vias: 59.69,33.02 59.69,45.09 59.69,57.78 59.69,70.48 59.69,95.89 59.69,83.19
+5V  (via drill 0.5 pad 1.27, 0.5 pad 1.78, 0.5 pad 2.18, 0.5 pad 2.54, 0.6)
  Top 0.813: IC201.4 10.79,124.46 13.34,127 v13.34,129.54 | IC202.4 32.38,124.46 34.92,127 v34.92,129.54 34.92,131.44 34.29,132.08 R206.2 | IC202.16 24.77,127 22.86,125.09 22.86,121.28 v18.41,116.84
  Top 1.27: X201.8 32.55,142.07 v34.29,140.34 33.66,139.7 21.59,139.7 21.48,139.81 v21.48,140.18 X201.4
  Bottom 0.406: 34.29,127 C203.1
  Bottom 0.813: 3.17,127 IC201.16 | 34.92,127 v34.92,129.54 34.92,131.44 35.56,132.08 R205.2 | 13.34,127 v13.34,129.54 13.34,132.08 | R203.2 11.43,119.38 10.79,120.02 IC201.4 | 13.34,132.08 R201.2 | 13.34,132.08 R202.2 | R204.2 33.02,119.38 32.38,120.02 IC202.4
  Bottom 1.27: 12.06,127 3.17,127 | 12.06,127 13.34,127 24.77,127 | 24.77,127 34.29,127 34.92,127 45.72,127 47.62,128.91 47.62,137.79 45.21,140.21 C201.+ 45.21,146.56 43.81,147.96 35.56,147.96 33.67,146.06 33.67,143.21 X201.8 34.3,140.34 | 24.77,127 IC202.16 | 12.06,127 C202.1 | 21.48,139.85 v21.48,140.18 21.48,142.24
  other vias: 3.17,129.54 10.79,121.92 32.38,121.92 24.77,129.54 21.48,142.09 32.55,142.09 45.21,144.15
+12V  (via drill 0.5 pad 2.18)  (3 unrouted)
  Bottom 1.27: R102.2 R402.2 HI401.1 R502.2 HI501.1 R602.2 HI601.1
  other vias: 8.89,83.19 8.89,57.78 8.89,33.02 8.89,37.47 8.89,62.23 8.89,87.63 8.89,94.61
+12V_TEMP
  Bottom 1.27: SV101.16 SV101.15
+15V  (1 unrouted)
  Bottom 1.27: SV101.10 SV101.9
-12V  (via drill 0.5 pad 2.18)  (3 unrouted)
  Bottom 1.27: HI601.3 HI501.3 HI401.3 R101.2
  other vias: 13.97,83.19 13.97,57.78 13.97,33.02 13.97,94.61
-15V  (1 unrouted)
  Bottom 1.27: SV101.8 SV101.7
A  (via drill 0.5 pad 1.78, 0.5 pad 2.18)
  Bottom 0.762: 8.26,132.08 R207.1
  Bottom 0.813: X201.1 13.17,137.63 8.26,132.72 8.26,132.08 v8.26,129.54 | R207.1 R201.1
  other vias: 13.17,142.09
A_OUT  (via drill 0.6 pad 2.18)
  Top 0.508: 9.53,120.02 9.53,123.83
  Top 0.813: IC201.13 10.79,126.36 9.53,125.09 9.53,123.83 | 9.53,120.02 10.79,118.75 v10.79,116.84
AGND  (via drill 0.5 pad 2.18)  (2 unrouted)
  Top 1.27: v11.43,80.01 v19.05,80.01 | v11.43,54.61 v19.05,54.61 | v11.43,29.84 v19.05,29.84
  Bottom 0.813: HI401.6 R406.2 | HI501.6 R506.2 | HI601.6 R606.2
  Bottom 1.27: 16.51,97.16 12.7,97.16 11.43,95.89 HI401.2 v11.43,80.01 C401.2 C402.2 HI501.2 v11.43,54.61 C501.2 C502.2 HI601.2 v11.43,29.84 C601.2 C602.2 | 16.51,97.16 v16.51,111.76 | 16.51,97.16 20.32,97.16 21.59,95.89 HI401.6 HI401.5 v19.05,80.01 | HI501.6 HI501.5 v19.05,54.61 | SV101.12 SV101.11 | HI601.6 HI601.5 v19.05,29.84
  other vias: 11.43,83.19 11.43,57.78 11.43,33.02 21.59,33.02 21.59,57.78 21.59,83.19 19.05,83.19 19.05,57.78 19.05,33.02 21.59,80.01 11.43,73.66 11.43,68.58 21.59,29.84 11.43,18.41 11.43,23.5 21.59,54.61 11.43,48.26 11.43,43.18
AN  (via drill 0.5 pad 1.78, 0.5 pad 2.18)
  Bottom 0.813: X201.9 13.49,144.93 11.43,142.88 11.43,138.43 5.71,132.72 5.71,132.08 | 5.71,132.08 IC201.15 | 5.71,132.08 R207.2 R213.2
  other vias: 5.71,129.54 14.55,144.93
B  (via drill 0.5 pad 1.27, 0.5 pad 1.78)
  Bottom 0.762: IC201.10 18.41,132.08 R208.1
  Bottom 0.813: X201.2 15.94,135.19 18.41,132.72 18.41,132.08 | R202.1 R208.1
  other vias: 18.41,129.54 15.94,142.09
B_OUT  (via drill 0.6 pad 2.18)
  Top 0.508: 12.06,120.02 12.06,123.83
  Top 0.813: IC201.11 15.88,127.64 12.06,123.83 | 12.06,120.02 13.34,118.75 v13.34,116.84
BN  (via drill 0.5 pad 1.27, 0.5 pad 1.78)
  Top 0.813: R214.2 20.95,131.66 IC201.9
  Bottom 0.406: 17.32,141.15 17.32,143.05
  Bottom 0.762: IC201.9 20.95,132.08 R208.2
  Bottom 0.813: 17.32,143.05 X201.10 | 17.32,141.15 17.32,136.35 20.95,132.72 20.95,132.08
  other vias: 20.95,129.54 17.32,144.93
CURRENT_A  (1 unrouted)
CURRENT_B  (1 unrouted)
CURRENT_C  (1 unrouted)
CURRENT_FB_U  (via drill 0.5 pad 2.18)
  Bottom 0.813: R402.1 R403.1
  Bottom 1.27: HI401.4 R402.1
  other vias: 19.05,87.63 16.51,87.63 19.05,87.63 16.51,83.19
CURRENT_FB_V  (via drill 0.5 pad 2.18)
  Bottom 0.813: R502.1 R503.1
  Bottom 1.27: HI501.4 R502.1
  other vias: 21.59,62.23 16.51,62.23 21.59,62.23 16.51,57.78
CURRENT_FB_W  (via drill 0.5 pad 2.18)
  Bottom 0.813: R602.1 R603.1
  Bottom 1.27: HI601.4 R602.1
  other vias: 21.59,37.47 16.51,37.47 21.59,37.47 16.51,33.02
CURRENT_REF  (via drill 0.5 pad 2.18)  (1 unrouted)
  other vias: 67.94,128.91
CURRENT_SP_U  (via drill 0.5 pad 2.18)
  Bottom 0.813: HI401.10 44.45,84.45 43.18,85.72 25.4,85.72 24.13,84.45 HI401.7 24.13,78.74 22.86,77.47 R401.1
  other vias: 44.45,83.19 24.13,83.19 21.59,77.47
CURRENT_SP_V  (via drill 0.5 pad 2.18)
  Bottom 0.813: HI501.10 44.45,59.05 43.18,60.33 25.4,60.33 24.13,59.05 HI501.7 24.13,53.34 22.86,52.07 R501.1
  other vias: 44.45,57.78 24.13,57.78 21.59,52.07
CURRENT_SP_W  (via drill 0.5 pad 2.18)
  Bottom 0.813: HI601.10 44.45,34.29 43.18,35.56 25.4,35.56 24.13,34.29 HI601.7 24.13,28.57 22.86,27.3 R601.1
  other vias: 44.45,33.02 24.13,33.02 21.59,27.3
ENABLE  (via drill 0.5 pad 2.18)  (1 unrouted)
  Bottom 1.27: HI601.18 HI602.6 HI501.18 HI502.6 HI401.18 HI402.6 v64.77,98.42
  other vias: 64.77,33.02 64.77,45.09 64.77,57.78 64.77,70.48 64.77,95.89 64.77,83.19
F/!B  (via drill 0.5 pad 2.18)  (1 unrouted)
  other vias: 65.41,128.91
FB_ANGLE  (via drill 0.5 pad 2.18)  (1 unrouted)
  other vias: 70.48,128.91
GND  (via drill 0.5 pad 1.78, 0.5 pad 2.18, 0.5 pad 2.54, 0.5 pad 6.45)  (2 unrouted)
  Top 0.813: v39.37,143.51 45.72,137.16 45.72,125.09 IC202.8 | IC201.8 20.95,125.09 22.86,127 22.86,130.81 23.07,131.03 R214.1 R218.1
  Bottom 0.406: 34.29,124.46 C203.2
  Bottom 0.813: v6.35,143.51 6.35,147.32 8.89,149.86 19.68,149.86 22.86,146.69 | 22.86,119.38 R215.1 | R217.1 45.94,136.94 v39.37,143.51 | R213.1 1.91,132.08 1.27,131.44 1.27,125.09 1.91,124.46 3.17,124.46 | R216.1 43.4,121.07 IC202.8
  Bottom 1.27: 20.95,124.46 IC201.8 22.86,120.02 22.86,119.38 22.86,118.75 v20.95,116.84 | 3.17,124.46 12.06,124.46 | 12.06,124.46 20.95,124.46 | 20.95,124.46 34.29,124.46 42.55,124.46 | 42.55,124.46 IC202.8 | 12.06,124.46 C202.2 | X201.12 22.86,146.69 26.04,149.86 45.72,149.86 48.77,146.81 C201.- 49.53,143.38 49.53,127 46.99,124.46 42.55,124.46 | HI601.17 HI602.5 HI501.17 HI502.5 HI401.17 HI402.5 v62.23,98.42
  other vias: 20.95,121.92 42.55,121.92 22.86,144.93 48.77,144.15 62.23,33.02 62.23,45.09 62.23,57.78 62.23,70.48 62.23,95.89 62.23,83.19
I2C  (1 unrouted)
N$2  (via drill 0.5 pad 2.18)
  other vias: 10.79,129.54
N$6  (via drill 0.5 pad 2.18)
  other vias: 52.07,70.48
N$7  (via drill 0.5 pad 2.18)
  other vias: 52.07,45.09
N$9  (via drill 0.5 pad 1.27, 0.5 pad 2.18)
  Bottom 0.813: v8.26,116.84 v8.26,121.92
N$10  (via drill 0.5 pad 1.27)
  other vias: 13.34,121.92
N$12  (via drill 0.5 pad 2.18)
  other vias: 52.07,95.89
N$13  (via drill 0.5 pad 2.18)
  other vias: 54.61,95.89
N$14  (via drill 0.5 pad 1.27)
  other vias: 34.92,121.92
N$15  (via drill 0.5 pad 2.18)
  other vias: 32.38,129.54
N$16  (via drill 0.5 pad 1.27)
  other vias: 37.47,129.54
N$17  (via drill 0.5 pad 1.27)
  other vias: 15.88,129.54
N$18  (via drill 0.5 pad 2.18)
  other vias: 57.15,95.89
N$19  (via drill 0.5 pad 2.18)
  other vias: 54.61,70.48
N$20  (via drill 0.5 pad 2.18)
  other vias: 57.15,70.48
N$24  (via drill 0.5 pad 2.18)
  other vias: 54.61,45.09
N$25  (via drill 0.5 pad 2.18)
  Bottom 0.813: v3.17,116.84 v3.17,121.92
N$26  (via drill 0.5 pad 2.18)
  Bottom 0.813: v5.71,116.84 v5.71,121.92
N$28  (via drill 0.5 pad 2.18)
  other vias: 57.15,45.09
N$29  (via drill 0.5 pad 2.18)
  Bottom 0.813: v24.77,116.84 v24.77,121.92
N$30  (1 unrouted)
N$31  (via drill 0.5 pad 2.18)
  Bottom 0.813: v27.3,116.84 v27.3,121.92
N$32  (via drill 0.5 pad 1.27, 0.5 pad 2.18)
  Bottom 0.813: v29.84,116.84 v29.84,121.92
N$33  (via drill 0.5 pad 2.18)
  other vias: 46.99,33.02
N$34  (1 unrouted)
N$35  (via drill 0.5 pad 2.18)
  other vias: 49.53,33.02
N$36  (1 unrouted)
N$37  (1 unrouted)
N$38  (1 unrouted)
N$39  (1 unrouted)
N$40  (1 unrouted)
N$41  (1 unrouted)
N$42  (via drill 0.5 pad 2.18)
  other vias: 52.07,33.02
N$43  (via drill 0.5 pad 2.18)
  other vias: 54.61,33.02
N$44  (via drill 0.5 pad 2.18)
  other vias: 57.15,33.02
N$45  (via drill 0.5 pad 2.18)
  other vias: 46.99,57.78
N$46  (via drill 0.5 pad 2.18)
  other vias: 49.53,57.78
N$47  (via drill 0.5 pad 2.18)
  other vias: 52.07,57.78
N$48  (via drill 0.5 pad 2.18)
  other vias: 54.61,57.78
N$49  (via drill 0.5 pad 2.18)
  other vias: 57.15,57.78
N$50  (via drill 0.5 pad 2.18)
  other vias: 46.99,83.19
N$51  (via drill 0.5 pad 2.18)
  other vias: 49.53,83.19
N$52  (via drill 0.5 pad 2.18)
  other vias: 52.07,83.19
N$53  (via drill 0.5 pad 2.18)
  other vias: 54.61,83.19
N$54  (via drill 0.5 pad 2.18)
  other vias: 57.15,83.19
N$55  (via drill 0.5 pad 2.18)
  Bottom 0.813: 29.21,76.2 R401.2 | R410.1 27.94,69.85 26.67,71.12 26.67,76.2 | 26.67,76.2 HI401.8 | 29.21,76.2 R405.1 | 26.67,76.2 29.21,76.2
  other vias: 29.21,74.93 29.21,69.85 26.67,83.19 29.21,77.47
N$56  (via drill 0.5 pad 2.18)
  Bottom 0.813: C401.1 21.59,73.66 | 21.59,73.66 R405.2 | 21.59,73.66 R404.1
  other vias: 21.59,72.39 21.59,74.93 16.51,73.66
N$57  (via drill 0.5 pad 2.18)
  Bottom 1.27: R406.1 HI401.9
  other vias: 29.21,80.01 29.21,83.19
N$58  (via drill 0.5 pad 2.18)
  Bottom 0.813: 21.59,68.58 R409.1 | 21.59,68.58 R410.2 | C402.1 21.59,68.58
  other vias: 21.59,67.31 21.59,69.85 16.51,68.58
N$59  (1 unrouted)
N$60  (1 unrouted)
N$61  (1 unrouted)
N$62  (via drill 0.5 pad 2.18)
  Bottom 0.813: 29.21,50.8 R501.2 | 26.67,50.8 26.67,45.72 27.94,44.45 R510.1 | 26.67,50.8 HI501.8 | 29.21,50.8 R505.1 | 26.67,50.8 29.21,50.8
  other vias: 26.67,57.78 29.21,52.07 29.21,49.53 29.21,44.45
N$63  (via drill 0.5 pad 2.18)
  Bottom 0.813: 21.59,48.26 R504.1 | 21.59,48.26 R505.2 | C501.1 21.59,48.26
  other vias: 16.51,48.26 21.59,49.53 21.59,46.99
N$64  (via drill 0.5 pad 2.18)
  Bottom 0.813: R506.1 HI501.9
  other vias: 29.21,57.78 29.21,54.61
N$65  (via drill 0.5 pad 2.18)
  Bottom 0.813: 21.59,43.18 R509.1 | 21.59,43.18 R510.2 | C502.1 21.59,43.18
  other vias: 21.59,44.45 21.59,41.91 16.51,43.18
N$66  (1 unrouted)
N$67  (1 unrouted)
N$68  (1 unrouted)
N$69  (via drill 0.5 pad 2.18)
  Bottom 0.813: 26.67,26.04 26.67,20.95 27.94,19.68 R610.1 | 26.67,26.04 HI601.8 | 29.21,26.04 R601.2 | 29.21,26.04 R605.1 | 26.67,26.04 29.21,26.04
  other vias: 26.67,33.02 29.21,27.3 29.21,24.77 29.21,19.68
N$70  (via drill 0.5 pad 2.18)
  Bottom 0.813: 21.59,23.5 R604.1 | 21.59,23.5 R605.2 | C601.1 21.59,23.5
  other vias: 21.59,24.77 21.59,22.23 16.51,23.5
N$71  (via drill 0.5 pad 2.18)
  Bottom 0.813: R606.1 HI601.9
  other vias: 29.21,33.02 29.21,29.84
N$72  (via drill 0.5 pad 2.18)
  Bottom 0.813: 21.59,18.41 R609.1 | 21.59,18.41 R610.2 | C602.1 21.59,18.41
  other vias: 21.59,19.68 21.59,17.14 16.51,18.41
N$73  (1 unrouted)
N$74  (1 unrouted)
N$75  (1 unrouted)
ON  (via drill 0.5 pad 2.18)  (1 unrouted)
  other vias: 62.87,128.91
OSC  (via drill 0.5 pad 2.18)  (1 unrouted)
  Bottom 1.27: HI601.19 HI602.7 HI501.19 HI502.7 HI401.19 HI402.7 v67.31,98.42
  other vias: 67.31,33.02 67.31,45.09 67.31,57.78 67.31,70.48 67.31,95.89 67.31,83.19
U  (via drill 0.5 pad 1.78, 0.5 pad 2.18)
  Top 0.813: R206.1 29.84,131.66 v29.84,129.54
  Bottom 0.813: 29.84,130.81 v29.84,129.54 29.84,132.08 | X201.5 24.24,138.32 29.84,132.72 29.84,132.08 | 29.84,132.08 R212.1
  other vias: 24.24,142.09
U_DIRECTION  (via drill 0.5 pad 2.18)  (1 unrouted)
  Bottom 0.61: HI402.9 72.39,97.79 73.03,98.42 83.19,98.42 84.45,97.16 85.72,97.16 v87.63,99.06 85.72,100.97 71.12,100.97 67.94,104.14 v67.94,111.76
  other vias: 72.39,95.89 144.78,144.78
U_ENABLE  (via drill 0.5 pad 2.18)  (1 unrouted)
  Bottom 0.61: HI402.8 69.85,99.69 | 69.85,99.69 84.45,99.69 v85.09,99.06 | 69.85,99.69 65.41,104.14 v65.41,111.76
  other vias: 69.85,95.89 142.24,144.78
U_ENABLE_G1  (via drill 0.5 pad 2.18)
  Bottom 1.27: HI401.20 HI401.21 72.39,88.27 74.93,90.81 HI402.10
  other vias: 74.93,95.89 69.85,83.19 72.39,83.19
U_ENABLE_G2  (via drill 0.5 pad 2.18)
  Bottom 1.27: HI401.22 HI401.23 HI402.11
  other vias: 77.47,95.89 74.93,83.19 77.47,83.19
U_OUT  (via drill 0.6 pad 2.18)
  Top 0.508: 31.11,120.02 31.11,123.83
  Top 0.813: IC202.13 32.38,126.36 31.11,125.09 31.11,123.83 | 31.11,120.02 32.38,118.75 v32.38,116.84
UART  (1 unrouted)
UN  (via drill 0.5 pad 1.78, 0.5 pad 2.18)
  Top 0.813: IC202.15 27.3,131.66 R218.2
  Bottom 0.406: 23.65,143.66 22.86,142.88 22.86,139.06
  Bottom 0.508: 24.77,144.15 24.13,144.15 22.86,142.88
  Bottom 0.813: IC202.15 27.3,132.08 | 27.3,132.08 27.3,132.72 22.86,137.16 22.86,139.06 | 27.3,132.08 R212.2 | X201.13 25.63,144.37 25.4,144.15 24.77,144.15
  other vias: 27.3,129.54 25.63,144.93
V  (via drill 0.5 pad 1.27, 0.5 pad 1.78)
  Bottom 0.762: 40.01,132.72 40.01,132.08
  Bottom 0.813: X201.6 27.01,138.72 32.38,133.35 39.37,133.35 40.01,132.72 | IC202.10 40.01,132.08 R211.1 R205.1
  other vias: 40.01,129.54 27.01,142.09
V_DIRECTION  (via drill 0.5 pad 2.18)  (1 unrouted)
  Bottom 0.61: v73.03,111.76 73.03,105.41 74.93,103.5 89.53,103.5 92.71,100.33 v92.71,99.06 92.71,74.93 91.44,73.66 73.66,73.66 72.39,72.39 HI502.9
  other vias: 72.39,70.48 149.86,144.78
V_ENABLE  (via drill 0.5 pad 2.18)  (1 unrouted)
  Bottom 0.61: v70.48,111.76 70.48,104.14 72.39,102.23 88.27,102.23 90.17,100.33 v90.17,99.06 90.17,76.2 88.9,74.93 71.12,74.93 69.85,73.66 HI502.8
  other vias: 69.85,70.48 147.32,144.78
V_ENABLE_G1  (via drill 0.5 pad 2.18)
  Bottom 1.27: HI501.20 HI501.21 72.39,62.87 74.93,65.41 HI502.10
  other vias: 69.85,57.78 72.39,57.78 74.93,70.48
V_ENABLE_G2  (via drill 0.5 pad 2.18)
  Bottom 1.27: HI501.22 HI501.23 HI502.11
  other vias: 77.47,57.78 74.93,57.78 77.47,70.48
V_OUT  (via drill 0.6 pad 2.18)
  Top 0.508: 33.66,120.02 33.66,123.83
  Top 0.813: IC202.11 37.47,127.64 33.66,123.83 | 33.66,120.02 34.92,118.75 v34.92,116.84
VN  (via drill 0.5 pad 1.27, 0.5 pad 1.78)
  Bottom 0.406: 28.4,141.15 28.4,143.33
  Bottom 0.762: 42.55,132.08 R211.2
  Bottom 0.813: IC202.9 42.55,132.08 42.55,132.72 40.64,134.62 33.02,134.62 28.4,139.24 28.4,141.15 | 28.4,143.33 X201.14 | R211.2 R217.2
  other vias: 42.55,129.54 28.4,144.93
W  (via drill 0.5 pad 1.78, 0.5 pad 2.18, 0.6 pad 1.78)
  Top 0.508: 38.73,127.64 38.73,132.08
  Top 0.813: IC202.6 37.47,125.09 38.73,126.36 38.73,127.64 | 38.73,132.08 37.47,133.35 v37.47,136.53
  Bottom 0.762: IC202.6 37.47,119.53 R210.1
  Bottom 0.813: X201.7 29.78,139.76 33.02,136.53 v37.47,136.53 | R204.1 R210.1
  other vias: 37.47,121.92 29.78,142.09
W_DIRECTION  (via drill 0.5 pad 2.18)  (1 unrouted)
  Bottom 0.61: v78.11,111.76 78.11,107.95 80.01,106.05 92.08,106.05 97.79,100.33 v97.79,99.06 97.79,49.53 96.52,48.26 73.66,48.26 72.39,46.99 HI602.9
  other vias: 72.39,45.09 154.94,144.78
W_ENABLE  (via drill 0.5 pad 2.18)  (1 unrouted)
  Bottom 0.61: v75.56,111.76 75.56,106.68 77.47,104.78 90.81,104.78 95.25,100.33 v95.25,99.06 95.25,50.8 93.98,49.53 71.75,49.53 69.85,47.62 HI602.8
  other vias: 69.85,45.09 152.4,144.78
W_ENABLE_G1  (via drill 0.5 pad 2.18)
  Bottom 1.27: HI601.20 HI601.21 72.39,37.47 74.93,40.01 HI602.10
  other vias: 69.85,33.02 72.39,33.02 74.93,45.09
W_ENABLE_G2  (via drill 0.5 pad 2.18)
  Bottom 1.27: HI601.22 HI601.23 HI602.11
  other vias: 77.47,33.02 77.47,45.09 74.93,33.02
W_OUT  (via drill 0.6 pad 2.18)
  Top 0.813: v37.47,116.84 37.47,118.75 34.92,121.28 IC202.5
WN  (via drill 0.5 pad 1.78, 0.5 pad 2.18, 0.6 pad 1.78)
  Top 0.508: 41.27,127.64 41.27,132.08
  Top 0.813: IC202.7 40.01,125.09 41.27,126.36 41.27,127.64 | 41.27,132.08 40.01,133.35 v40.01,136.53
  Bottom 0.406: 31.17,140.92 31.17,142.93
  Bottom 0.762: IC202.7 40.01,119.53 R210.2
  Bottom 0.813: v40.01,136.53 38.1,138.43 33.02,138.43 31.17,140.28 31.17,140.92 | 31.17,142.93 X201.15 | R210.2 R216.2
  other vias: 40.01,121.92 31.17,144.93
Z  (via drill 0.5 pad 1.78, 0.5 pad 2.18, 0.6 pad 1.78)
  Top 0.508: 17.14,127.64 17.14,132.08
  Top 0.813: IC201.6 15.88,125.09 17.14,126.36 17.14,127.64 | 17.14,132.08 17.14,135.25 v19.05,137.16
  Bottom 0.762: IC201.6 15.88,119.53 R209.1
  Bottom 0.813: X201.3 18.71,137.45 v19.05,137.16 | R203.1 R209.1
  other vias: 15.88,121.92 18.71,142.09
Z_OUT  (via drill 0.6 pad 2.18)
  Top 0.813: v15.88,116.84 15.88,118.75 13.34,121.28 IC201.5
ZN  (via drill 0.5 pad 1.78, 0.5 pad 2.18, 0.6 pad 1.78)
  Top 0.508: 19.68,127.64 19.68,132.08
  Top 0.813: IC201.7 18.41,125.09 19.68,126.36 19.68,127.64 | 19.68,132.08 19.68,134.62 v20.95,135.89
  Bottom 0.406: 20.09,139.29 20.09,143.28
  Bottom 0.762: IC201.7 18.41,119.53 R209.2
  Bottom 0.813: 20.09,143.28 X201.11 | v20.95,135.89 20.95,137.79 20.09,138.66 20.09,139.29 | R215.2 R209.2
  other vias: 18.41,121.92 20.09,144.93

### Text on the board
tDocu: ON | F/!B | CURRENT_REF | FB_ANGLE | +3.3V | GND | ENABLE | OSC | U_ENABLE | U_DIRECTION | V_ENABLE | V_DIRECTION | W_ENABLE | W_DIRECTION | CURRENT_FB_U | CURRENT_SP_U | CURRENT_FB_V | CURRENT_SP_V | CURRENT_FB_W | CURRENT_SP_W